# EAGLE design audio_capelet (EAGLE 6.5.0)
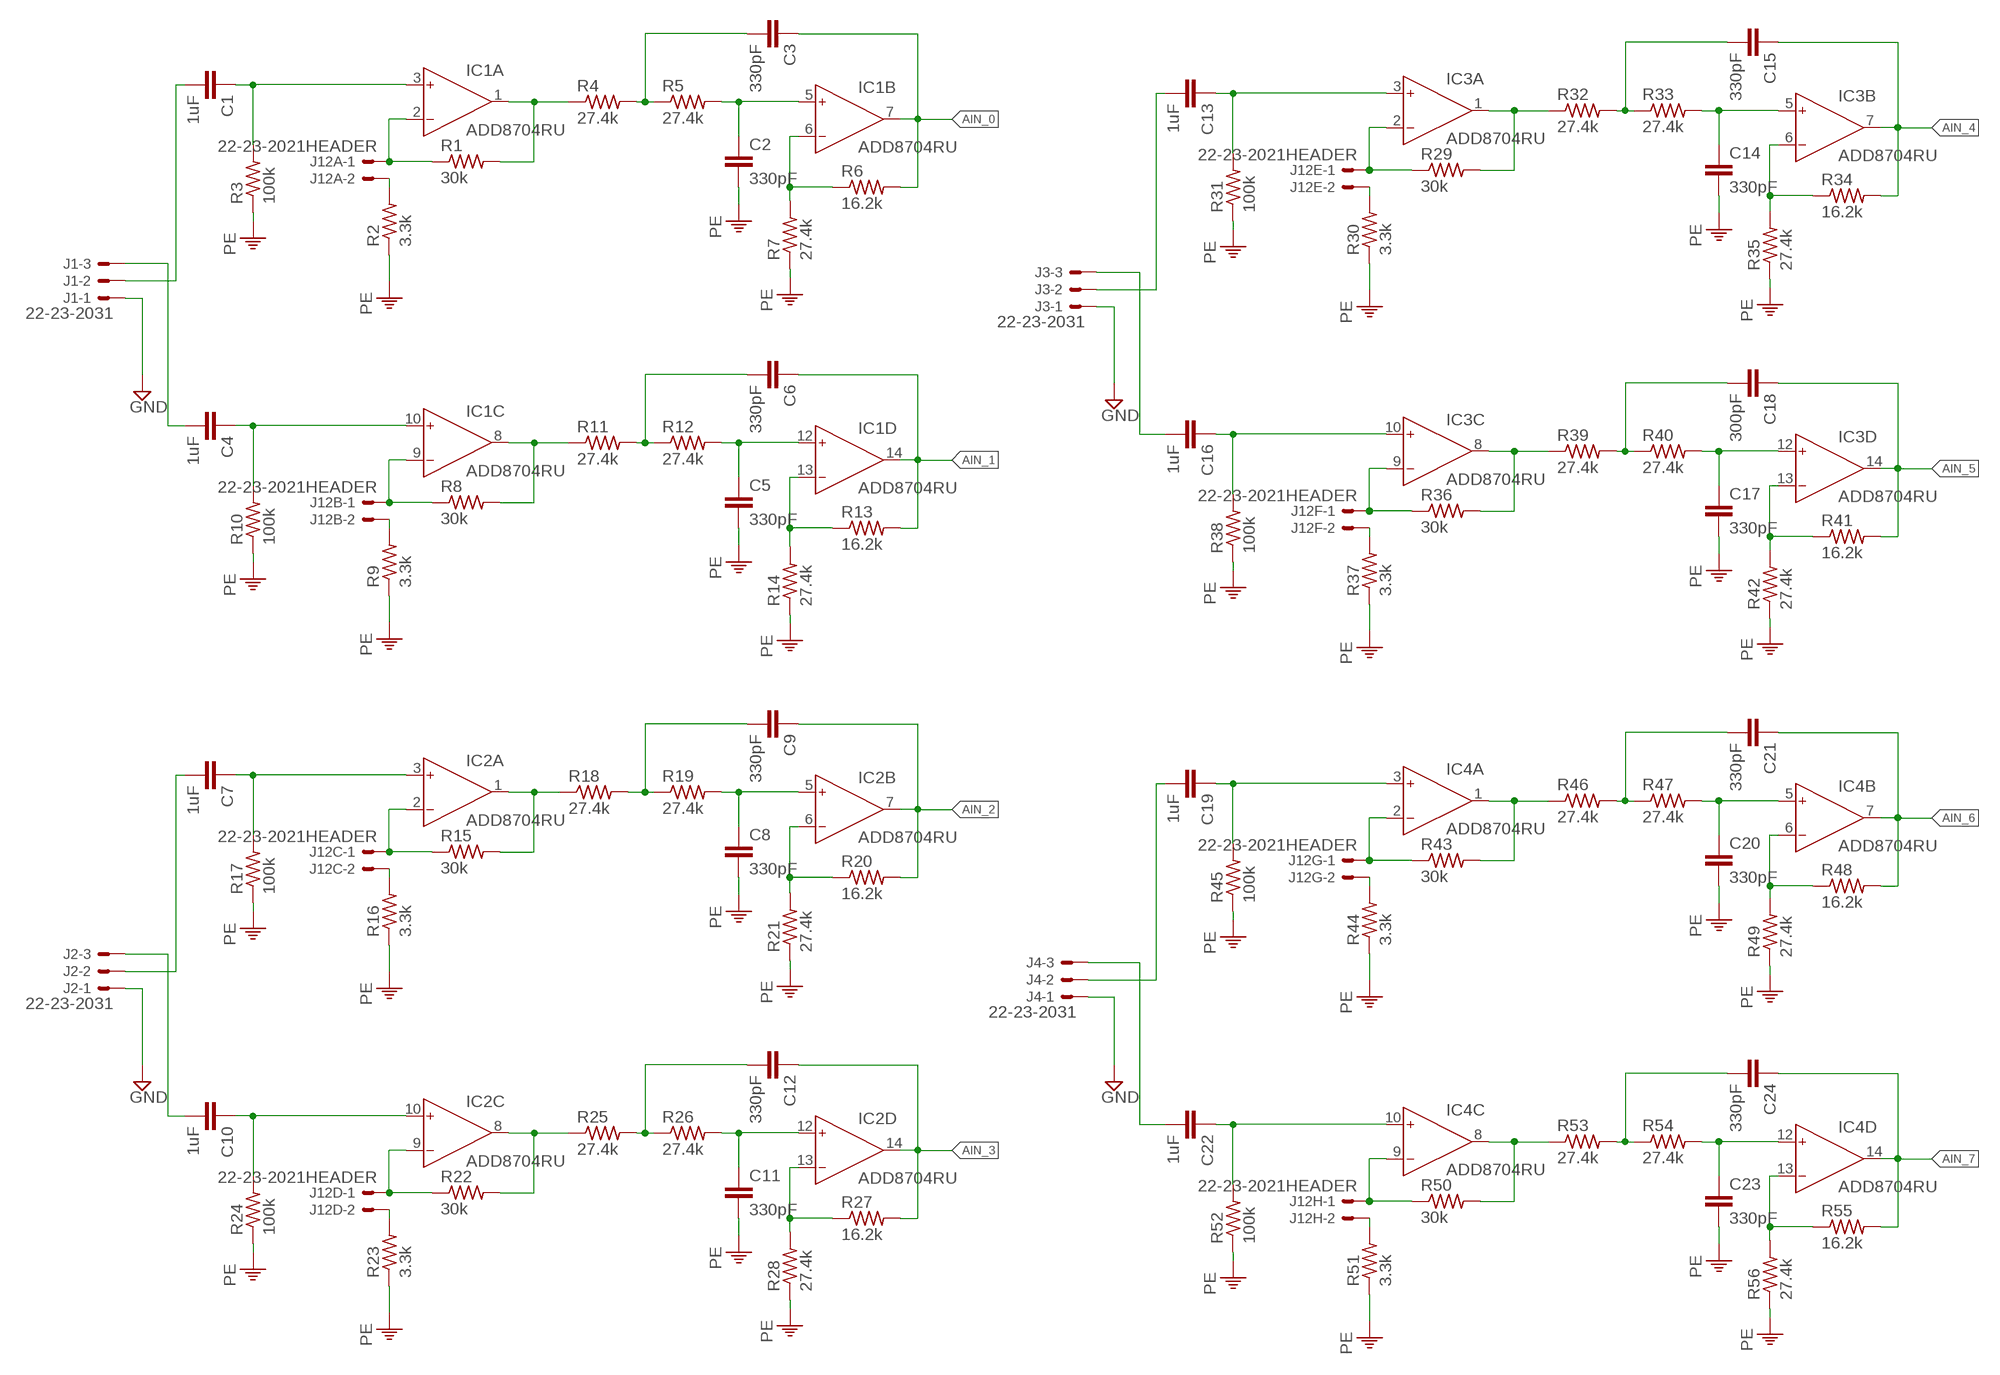
[diagram p0: schematic, sheet 1, part 1 of 2]
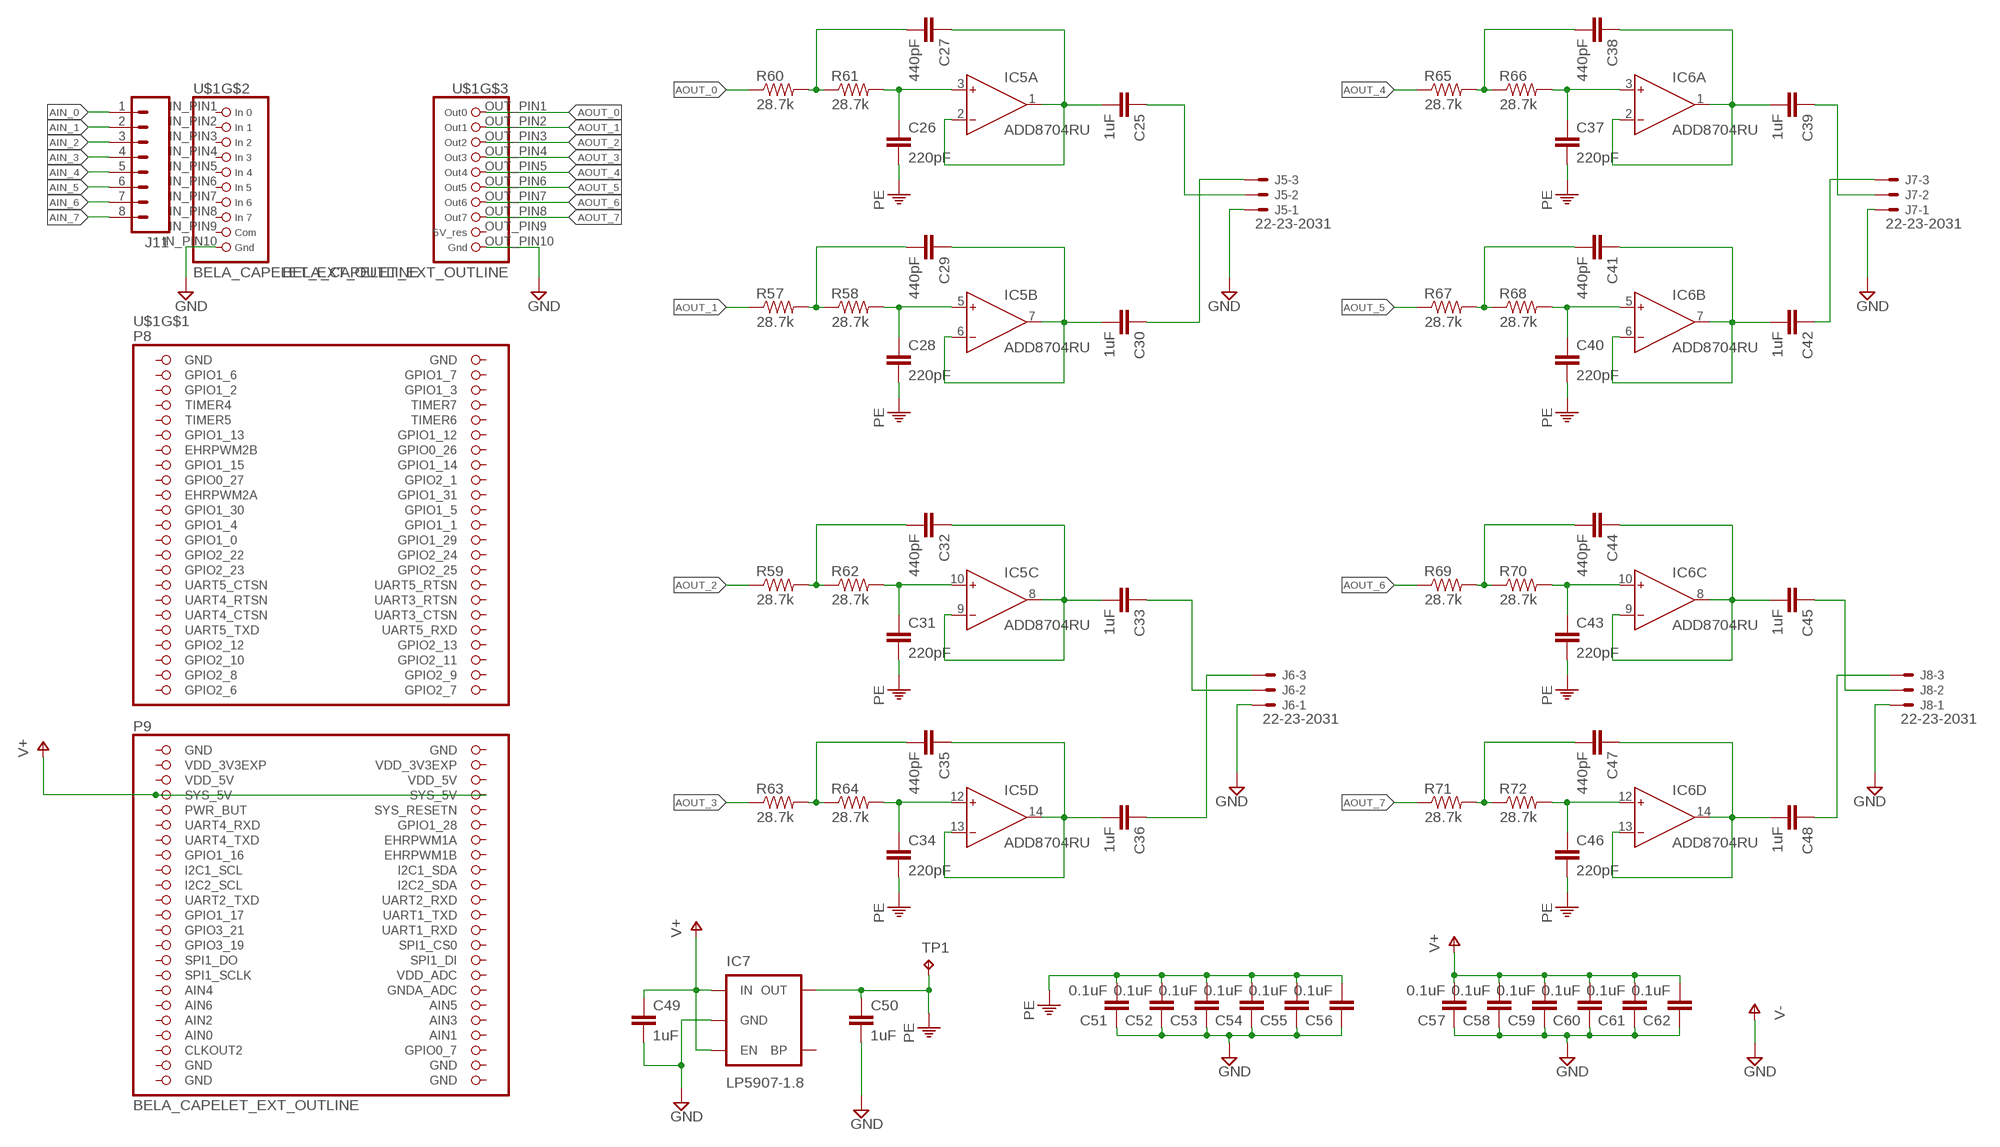
[diagram p1: schematic, sheet 1, part 2 of 2]

## Parts
C1  1uF  C-EUC0603  [C0603]
C2  330pF  C-EUC0603  [C0603]
C3  330pF  C-EUC0603  [C0603]
C4  1uF  C-EUC0603  [C0603]
C5  330pF  C-EUC0603  [C0603]
C6  330pF  C-EUC0603  [C0603]
C7  1uF  C-EUC0603  [C0603]
C8  330pF  C-EUC0603  [C0603]
C9  330pF  C-EUC0603  [C0603]
C10  1uF  C-EUC0603  [C0603]
C11  330pF  C-EUC0603  [C0603]
C12  330pF  C-EUC0603  [C0603]
C13  1uF  C-EUC0603  [C0603]
C14  330pF  C-EUC0603  [C0603]
C15  330pF  C-EUC0603  [C0603]
C16  1uF  C-EUC0603  [C0603]
C17  330pF  C-EUC0603  [C0603]
C18  300pF  C-EUC0603  [C0603]
C19  1uF  C-EUC0603  [C0603]
C20  330pF  C-EUC0603  [C0603]
C21  330pF  C-EUC0603  [C0603]
C22  1uF  C-EUC0603  [C0603]
C23  330pF  C-EUC0603  [C0603]
C24  330pF  C-EUC0603  [C0603]
C25  1uF  C-EUC0603  [C0603]
C26  220pF  C-EUC0603  [C0603]
C27  440pF  C-EUC0603  [C0603]
C28  220pF  C-EUC0603  [C0603]
C29  440pF  C-EUC0603  [C0603]
C30  1uF  C-EUC0603  [C0603]
C31  220pF  C-EUC0603  [C0603]
C32  440pF  C-EUC0603  [C0603]
C33  1uF  C-EUC0603  [C0603]
C34  220pF  C-EUC0603  [C0603]
C35  440pF  C-EUC0603  [C0603]
C36  1uF  C-EUC0603  [C0603]
C37  220pF  C-EUC0603  [C0603]
C38  440pF  C-EUC0603  [C0603]
C39  1uF  C-EUC0603  [C0603]
C40  220pF  C-EUC0603  [C0603]
C41  440pF  C-EUC0603  [C0603]
C42  1uF  C-EUC0603  [C0603]
C43  220pF  C-EUC0603  [C0603]
C44  440pF  C-EUC0603  [C0603]
C45  1uF  C-EUC0603  [C0603]
C46  220pF  C-EUC0603  [C0603]
C47  440pF  C-EUC0603  [C0603]
C48  1uF  C-EUC0603  [C0603]
C49  1uF  C-EUC0603  [C0603]
C50  1uF  C-EUC0603  [C0603]
C51  0.1uF  C-EUC0603  [C0603]
C52  0.1uF  C-EUC0603  [C0603]
C53  0.1uF  C-EUC0603  [C0603]
C54  0.1uF  C-EUC0603  [C0603]
C55  0.1uF  C-EUC0603  [C0603]
C56  0.1uF  C-EUC0603  [C0603]
C57  0.1uF  C-EUC0603  [C0603]
C58  0.1uF  C-EUC0603  [C0603]
C59  0.1uF  C-EUC0603  [C0603]
C60  0.1uF  C-EUC0603  [C0603]
C61  0.1uF  C-EUC0603  [C0603]
C62  0.1uF  C-EUC0603  [C0603]
IC1  ADD8704RU  [TSSOP14]
IC2  ADD8704RU  [TSSOP14]
IC3  ADD8704RU  [TSSOP14]
IC4  ADD8704RU  [TSSOP14]
IC5  ADD8704RU  [TSSOP14]
IC6  ADD8704RU  [TSSOP14]
IC7  LP5907-1.8  V_REG_LDOSMD  [SOT23-5]
J1  22-23-2031  [22-23-2031]
J2  22-23-2031  [22-23-2031]
J3  22-23-2031  [22-23-2031]
J4  22-23-2031  [22-23-2031]
J5  22-23-2031  [22-23-2031]
J6  22-23-2031  [22-23-2031]
J7  22-23-2031  [22-23-2031]
J8  22-23-2031  [22-23-2031]
J11  M08SMALL_DIAMETER  [1X08_SMALL_DIAMETER]
J12A  22-23-2021HEADER  [1X02]
J12B  22-23-2021HEADER  [1X02]
J12C  22-23-2021HEADER  [1X02]
J12D  22-23-2021HEADER  [1X02]
J12E  22-23-2021HEADER  [1X02]
J12F  22-23-2021HEADER  [1X02]
J12G  22-23-2021HEADER  [1X02]
J12H  22-23-2021HEADER  [1X02]
R1  30k  R-US_R0603  [R0603]
R2  3.3k  R-US_R0603  [R0603]
R3  100k  R-US_R0603  [R0603]
R4  27.4k  R-US_R0603  [R0603]
R5  27.4k  R-US_R0603  [R0603]
R6  16.2k  R-US_R0603  [R0603]
R7  27.4k  R-US_R0603  [R0603]
R8  30k  R-US_R0603  [R0603]
R9  3.3k  R-US_R0603  [R0603]
R10  100k  R-US_R0603  [R0603]
R11  27.4k  R-US_R0603  [R0603]
R12  27.4k  R-US_R0603  [R0603]
R13  16.2k  R-US_R0603  [R0603]
R14  27.4k  R-US_R0603  [R0603]
R15  30k  R-US_R0603  [R0603]
R16  3.3k  R-US_R0603  [R0603]
R17  100k  R-US_R0603  [R0603]
R18  27.4k  R-US_R0603  [R0603]
R19  27.4k  R-US_R0603  [R0603]
R20  16.2k  R-US_R0603  [R0603]
R21  27.4k  R-US_R0603  [R0603]
R22  30k  R-US_R0603  [R0603]
R23  3.3k  R-US_R0603  [R0603]
R24  100k  R-US_R0603  [R0603]
R25  27.4k  R-US_R0603  [R0603]
R26  27.4k  R-US_R0603  [R0603]
R27  16.2k  R-US_R0603  [R0603]
R28  27.4k  R-US_R0603  [R0603]
R29  30k  R-US_R0603  [R0603]
R30  3.3k  R-US_R0603  [R0603]
R31  100k  R-US_R0603  [R0603]
R32  27.4k  R-US_R0603  [R0603]
R33  27.4k  R-US_R0603  [R0603]
R34  16.2k  R-US_R0603  [R0603]
R35  27.4k  R-US_R0603  [R0603]
R36  30k  R-US_R0603  [R0603]
R37  3.3k  R-US_R0603  [R0603]
R38  100k  R-US_R0603  [R0603]
R39  27.4k  R-US_R0603  [R0603]
R40  27.4k  R-US_R0603  [R0603]
R41  16.2k  R-US_R0603  [R0603]
R42  27.4k  R-US_R0603  [R0603]
R43  30k  R-US_R0603  [R0603]
R44  3.3k  R-US_R0603  [R0603]
R45  100k  R-US_R0603  [R0603]
R46  27.4k  R-US_R0603  [R0603]
R47  27.4k  R-US_R0603  [R0603]
R48  16.2k  R-US_R0603  [R0603]
R49  27.4k  R-US_R0603  [R0603]
R50  30k  R-US_R0603  [R0603]
R51  3.3k  R-US_R0603  [R0603]
R52  100k  R-US_R0603  [R0603]
R53  27.4k  R-US_R0603  [R0603]
R54  27.4k  R-US_R0603  [R0603]
R55  16.2k  R-US_R0603  [R0603]
R56  27.4k  R-US_R0603  [R0603]
R57  28.7k  R-US_R0603  [R0603]
R58  28.7k  R-US_R0603  [R0603]
R59  28.7k  R-US_R0603  [R0603]
R60  28.7k  R-US_R0603  [R0603]
R61  28.7k  R-US_R0603  [R0603]
R62  28.7k  R-US_R0603  [R0603]
R63  28.7k  R-US_R0603  [R0603]
R64  28.7k  R-US_R0603  [R0603]
R65  28.7k  R-US_R0603  [R0603]
R66  28.7k  R-US_R0603  [R0603]
R67  28.7k  R-US_R0603  [R0603]
R68  28.7k  R-US_R0603  [R0603]
R69  28.7k  R-US_R0603  [R0603]
R70  28.7k  R-US_R0603  [R0603]
R71  28.7k  R-US_R0603  [R0603]
R72  28.7k  R-US_R0603  [R0603]
TP1  TPPAD1-17Y  [P1-17Y]
U$1  BELA_CAPELET_EXT_OUTLINE  [BELA_CAPELET_EXTENDED_OUTLINE]

## Nets
01: C30.1 J5.3
AIN_0: C3.1 IC1.7(B:OUT) J11.1 R6.2
AIN_1: C6.1 IC1.14(D:OUT) J11.2 R13.2
AIN_2: C9.1 IC2.7(B:OUT) J11.3 R20.2
AIN_3: C12.1 IC2.14(D:OUT) J11.4 R27.2
AIN_4: C15.1 IC3.7(B:OUT) J11.5 R34.2
AIN_5: C18.1 IC3.14(D:OUT) J11.6 R41.2
AIN_6: C21.1 IC4.7(B:OUT) J11.7 R48.2
AIN_7: C24.1 IC4.14(D:OUT) J11.8 R55.2
AOUT_0: R60.1 U$1.OUT_PIN1
AOUT_1: R57.1 U$1.OUT_PIN2
AOUT_2: R59.1 U$1.OUT_PIN3
AOUT_3: R63.1 U$1.OUT_PIN4
AOUT_4: R65.1 U$1.OUT_PIN5
AOUT_5: R67.1 U$1.OUT_PIN6
AOUT_6: R69.1 U$1.OUT_PIN7
AOUT_7: R71.1 U$1.OUT_PIN8
N$1: C2.1 IC1.5(B:IN+) R5.2
N$2: IC1.2(A:IN-) J12A.1 R1.1
N$3: IC1.1(A:OUT) R1.2 R4.1
N$4: C3.2 R4.2 R5.1
N$5: C25.2 C27.1 IC5.1(A:OUT) IC5.2(A:IN-)
N$6: IC1.6(B:IN-) R6.1 R7.2
N$7: C1.1 IC1.3(A:IN+) R3.2
N$8: J12A.2 R2.2
N$9: IC1.8(C:OUT) R8.2 R11.1
N$10: C6.2 R11.2 R12.1
N$11: C5.1 IC1.12(D:IN+) R12.2
N$12: C27.2 R60.2 R61.1
N$13: IC1.13(D:IN-) R13.1 R14.2
N$14: IC2.1(A:OUT) R15.2 R18.1
N$15: C4.1 IC1.10(C:IN+) R10.2
N$16: IC1.9(C:IN-) J12B.1 R8.1
N$17: C1.2 J1.2
N$18: C4.2 J1.3
N$19: IC2.2(A:IN-) J12C.1 R15.1
N$20: C9.2 R18.2 R19.1
N$21: C8.1 IC2.5(B:IN+) R19.2
N$22: C26.1 IC5.3(A:IN+) R61.2
N$23: IC2.6(B:IN-) R20.1 R21.2
N$24: J12C.2 R16.2
N$25: C7.1 IC2.3(A:IN+) R17.2
N$26: IC2.8(C:OUT) R22.2 R25.1
N$28: C12.2 R25.2 R26.1
N$29: C11.1 IC2.12(D:IN+) R26.2
N$30: C29.2 R57.2 R58.1
N$31: IC2.13(D:IN-) R27.1 R28.2
N$32: IC2.9(C:IN-) J12D.1 R22.1
N$33: J12D.2 R23.2
N$34: C10.1 IC2.10(C:IN+) R24.2
N$35: C7.2 J2.2
N$36: C10.2 J2.3
N$37: IC3.1(A:OUT) R29.2 R32.1
N$38: C15.2 R32.2 R33.1
N$39: C14.1 IC3.5(B:IN+) R33.2
N$40: C28.1 IC5.5(B:IN+) R58.2
N$41: IC3.6(B:IN-) R34.1 R35.2
N$42: C13.1 IC3.3(A:IN+) R31.2
N$43: IC3.2(A:IN-) J12E.1 R29.1
N$44: J12E.2 R30.2
N$45: IC3.8(C:OUT) R36.2 R39.1
N$46: C18.2 R39.2 R40.1
N$47: C17.1 IC3.12(D:IN+) R40.2
N$48: C29.1 C30.2 IC5.6(B:IN-) IC5.7(B:OUT)
N$49: IC3.13(D:IN-) R41.1 R42.2
N$50: C16.1 IC3.10(C:IN+) R38.2
N$51: IC3.9(C:IN-) J12F.1 R36.1
N$52: J12F.2 R37.2
N$53: C13.2 J3.2
N$54: C16.2 J3.3
N$55: IC4.1(A:OUT) R43.2 R46.1
N$56: C21.2 R46.2 R47.1
N$57: C20.1 IC4.5(B:IN+) R47.2
N$58: C32.2 R59.2 R62.1
N$59: IC4.6(B:IN-) R48.1 R49.2
N$60: C19.1 IC4.3(A:IN+) R45.2
N$61: IC4.2(A:IN-) J12G.1 R43.1
N$62: J12G.2 R44.2
N$63: IC4.8(C:OUT) R50.2 R53.1
N$64: C24.2 R53.2 R54.1
N$65: C23.1 IC4.12(D:IN+) R54.2
N$66: C31.1 IC5.10(C:IN+) R62.2
N$67: IC4.13(D:IN-) R55.1 R56.2
N$68: C22.1 IC4.10(C:IN+) R52.2
N$69: IC4.9(C:IN-) J12H.1 R50.1
N$70: J12H.2 R51.2
N$71: C19.2 J4.2
N$72: C22.2 J4.3
N$73: C32.1 C33.2 IC5.8(C:OUT) IC5.9(C:IN-)
N$74: C35.2 R63.2 R64.1
N$75: C34.1 IC5.12(D:IN+) R64.2
N$76: C35.1 C36.2 IC5.13(D:IN-) IC5.14(D:OUT)
N$77: C38.2 R65.2 R66.1
N$78: C37.1 IC6.3(A:IN+) R66.2
N$79: J12B.2 R9.2
N$80: C38.1 C39.2 IC6.1(A:OUT) IC6.2(A:IN-)
N$81: C41.2 R67.2 R68.1
N$82: C40.1 IC6.5(B:IN+) R68.2
N$83: C41.1 C42.2 IC6.6(B:IN-) IC6.7(B:OUT)
N$84: C44.2 R69.2 R70.1
N$85: C43.1 IC6.10(C:IN+) R70.2
N$86: C44.1 C45.2 IC6.8(C:OUT) IC6.9(C:IN-)
N$87: C47.2 R71.2 R72.1
N$88: C46.1 IC6.12(D:IN+) R72.2
N$89: C47.1 C48.2 IC6.13(D:IN-) IC6.14(D:OUT)
N$90: C45.1 J8.2
N$91: C39.1 J7.2
O0: C25.1 J5.2
O2: C33.1 J6.2
O3: C36.1 J6.3
O5: C42.1 J7.3
O7: C48.1 J8.3
PE: C2.2 C5.2 C8.2 C11.2 C14.2 C17.2 C20.2 C23.2 C26.2 C28.2 C31.2 C34.2 C37.2 C40.2 C43.2 C46.2 C50.1 C51.2 C52.2 C53.2 C54.2 C55.2 C56.2 IC7.5(OUT) R2.1 R3.1 R7.1 R9.1 R10.1 R14.1 R16.1 R17.1 R21.1 R23.1 R24.1 R28.1 R30.1 R31.1 R35.1 R37.1 R38.1 R42.1 R44.1 R45.1 R49.1 R51.1 R52.1 R56.1 TP1.TP
V+: C49.1 C57.2 C58.2 C59.2 C60.2 C61.2 C62.2 IC7.1(IN) IC7.3(EN) U$1.53(SYS_5V) U$1.54(SYS_5V)
V-: C49.2 C50.2 C51.1 C52.1 C53.1 C54.1 C55.1 C56.1 C57.1 C58.1 C59.1 C60.1 C61.1 C62.1 IC7.2(GND) J1.1 J2.1 J3.1 J4.1 J5.1 J6.1 J7.1 J8.1 U$1.IN_PIN10 U$1.OUT_PIN10 ; supply symbol labelled GND
Unconnected: IC7.4(BP) U$1.3(GPIO1_6) U$1.4(GPIO1_7) U$1.5(GPIO1_2) U$1.6(GPIO1_3) U$1.7(TIMER4) U$1.8(TIMER7) U$1.9(TIMER5) U$1.10(TIMER6) U$1.11(GPIO1_13) U$1.12(GPIO1_12) U$1.13(EHRPWM2B) U$1.14(GPIO0_26) U$1.15(GPIO1_15) U$1.16(GPIO1_14) U$1.17(GPIO0_27) U$1.18(GPIO2_1) U$1.19(EHRPWM2A) U$1.20(GPIO1_31) U$1.21(GPIO1_30) U$1.22(GPIO1_5) U$1.23(GPIO1_4) U$1.24(GPIO1_1) U$1.25(GPIO1_0) U$1.26(GPIO1_29) U$1.27(GPIO2_22) U$1.28(GPIO2_24) U$1.29(GPIO2_23) U$1.30(GPIO2_25) U$1.31(UART5_CTSN) U$1.32(UART5_RTSN) U$1.33(UART4_RTSN) U$1.34(UART3_RTSN) U$1.35(UART4_CTSN) U$1.36(UART3_CTSN) U$1.37(UART5_TXD) U$1.38(UART5_RXD) U$1.39(GPIO2_12) U$1.40(GPIO2_13) U$1.41(GPIO2_10) U$1.42(GPIO2_11) U$1.43(GPIO2_8) U$1.44(GPIO2_9) U$1.45(GPIO2_6) U$1.46(GPIO2_7) U$1.55(PWR_BUT) U$1.56(SYS_RESETN) U$1.57(UART4_RXD) U$1.58(GPIO1_28) U$1.59(UART4_TXD) U$1.60(EHRPWM1A) U$1.61(GPIO1_16) U$1.62(EHRPWM1B) U$1.63(I2C1_SCL) U$1.64(I2C1_SDA) U$1.65(I2C2_SCL) U$1.66(I2C2_SDA) U$1.67(UART2_TXD) U$1.68(UART2_RXD) U$1.69(GPIO1_17) U$1.70(UART1_TXD) U$1.71(GPIO3_21) U$1.72(UART1_RXD) U$1.73(GPIO3_19) U$1.74(SPI1_CS0) U$1.75(SPI1_DO) U$1.76(SPI1_DI) U$1.77(SPI1_SCLK) U$1.78(VDD_ADC) U$1.79(AIN4) U$1.80(GNDA_ADC) U$1.81(AIN6) U$1.82(AIN5) U$1.83(AIN2) U$1.84(AIN3) U$1.86(AIN1) U$1.87(CLKOUT2) U$1.88(GPIO0_7) U$1.IN_PIN1 U$1.IN_PIN2 U$1.IN_PIN3 U$1.IN_PIN4 U$1.IN_PIN5 U$1.IN_PIN6 U$1.IN_PIN7 U$1.IN_PIN8 U$1.IN_PIN9 U$1.OUT_PIN9

## Power pins joined to a net without a drawn wire
AIN0: U$1.85(AIN0)
V+: IC1.4(P:V+) IC2.4(P:V+) IC3.4(P:V+) IC4.4(P:V+) IC5.4(P:V+) IC6.4(P:V+)
V-: IC1.11(P:V-) IC2.11(P:V-) IC3.11(P:V-) IC4.11(P:V-) IC5.11(P:V-) IC6.11(P:V-) U$1.1(GND) U$1.2(GND) U$1.47(GND) U$1.48(GND) U$1.89(GND) U$1.90(GND) U$1.91(GND) U$1.92(GND)
VDD_3V3EXP: U$1.49(VDD_3V3EXP) U$1.50(VDD_3V3EXP)
VDD_5V: U$1.51(VDD_5V) U$1.52(VDD_5V)

## Library data of the parts
C1-C62 = resistor:C-EU: CAPACITOR, European symbol
IC1-IC6 = analog-devices:ADD8704: 16 V Quad Operational Amplifier Source: Ananlog Devices .. 780914713ADD8704_0.pdf; MF: ALTERA CORPORATION; MPN: ADD8704ARUZ-REEL; OC_FARNELL: unknown; OC_NEWARK: 59K0964
IC7 = PDue:V_REG_LDO: Voltage Regulator LDO Standard 150mA LDO voltage regulator in SOT-23 layout. Micrel part MIC5205. BP (by-pass) pin is used to lower output noise with 470pF cap.
J1-J8 = con-molex:22-23-2031: .100" (2.54mm) Center Header - 3 Pin; MF: MOLEX; MPN: 22-23-2031; OC_FARNELL: 1462950; OC_NEWARK: 30C0862
J11 = bela_capelet:M08: Header 8 Standard 8-pin 0.1" header. Use with straight break away headers (SKU : PRT-00116), right angle break away headers (PRT-00553), swiss pins (PRT-00743), machine pins (PRT-00117), and female headers (PRT-00115).
J12A J12B J12C J12D J12E J12F J12G J12H = PDue:22-23-2021: .100" (2.54mm) Center Header - 2 Pin
R1-R72 = resistor:R-US_: RESISTOR, American symbol
TP1 = testpad:TP: Test pad
U$1 = bela_capelet:BELA_CAPELET: Should match A3 pinout - but not completely tested

## Board
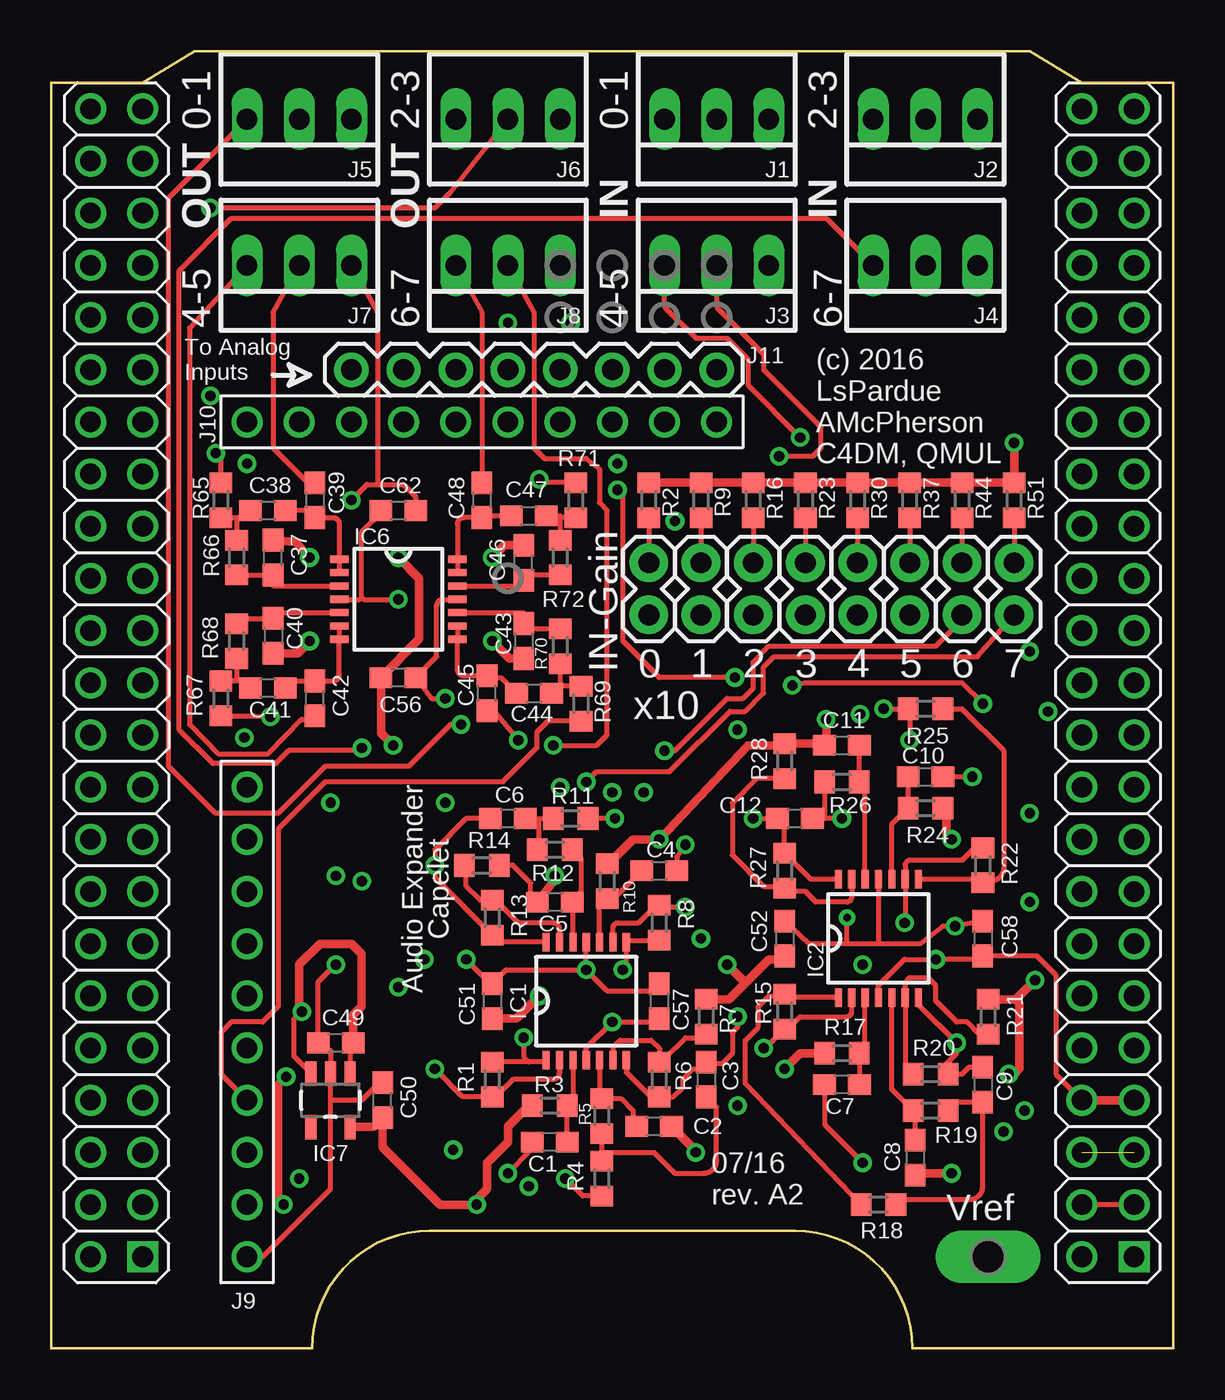
[diagram p2: board, top side]
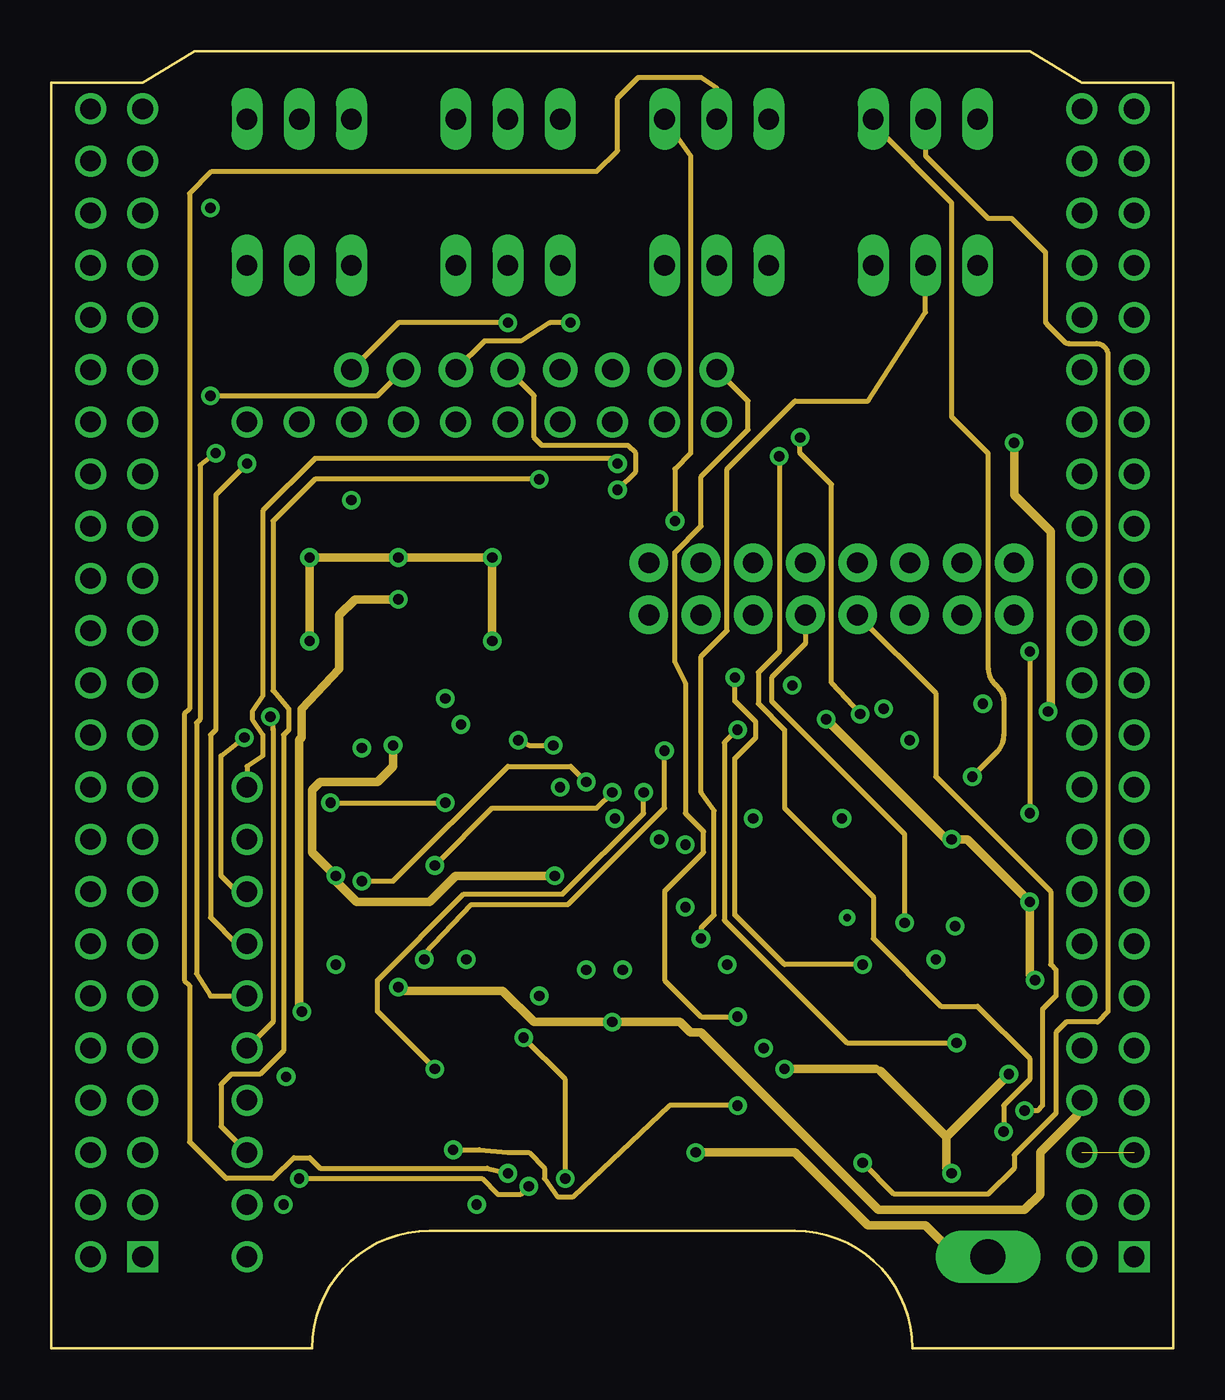
[diagram p3: board, inner layer Route2]
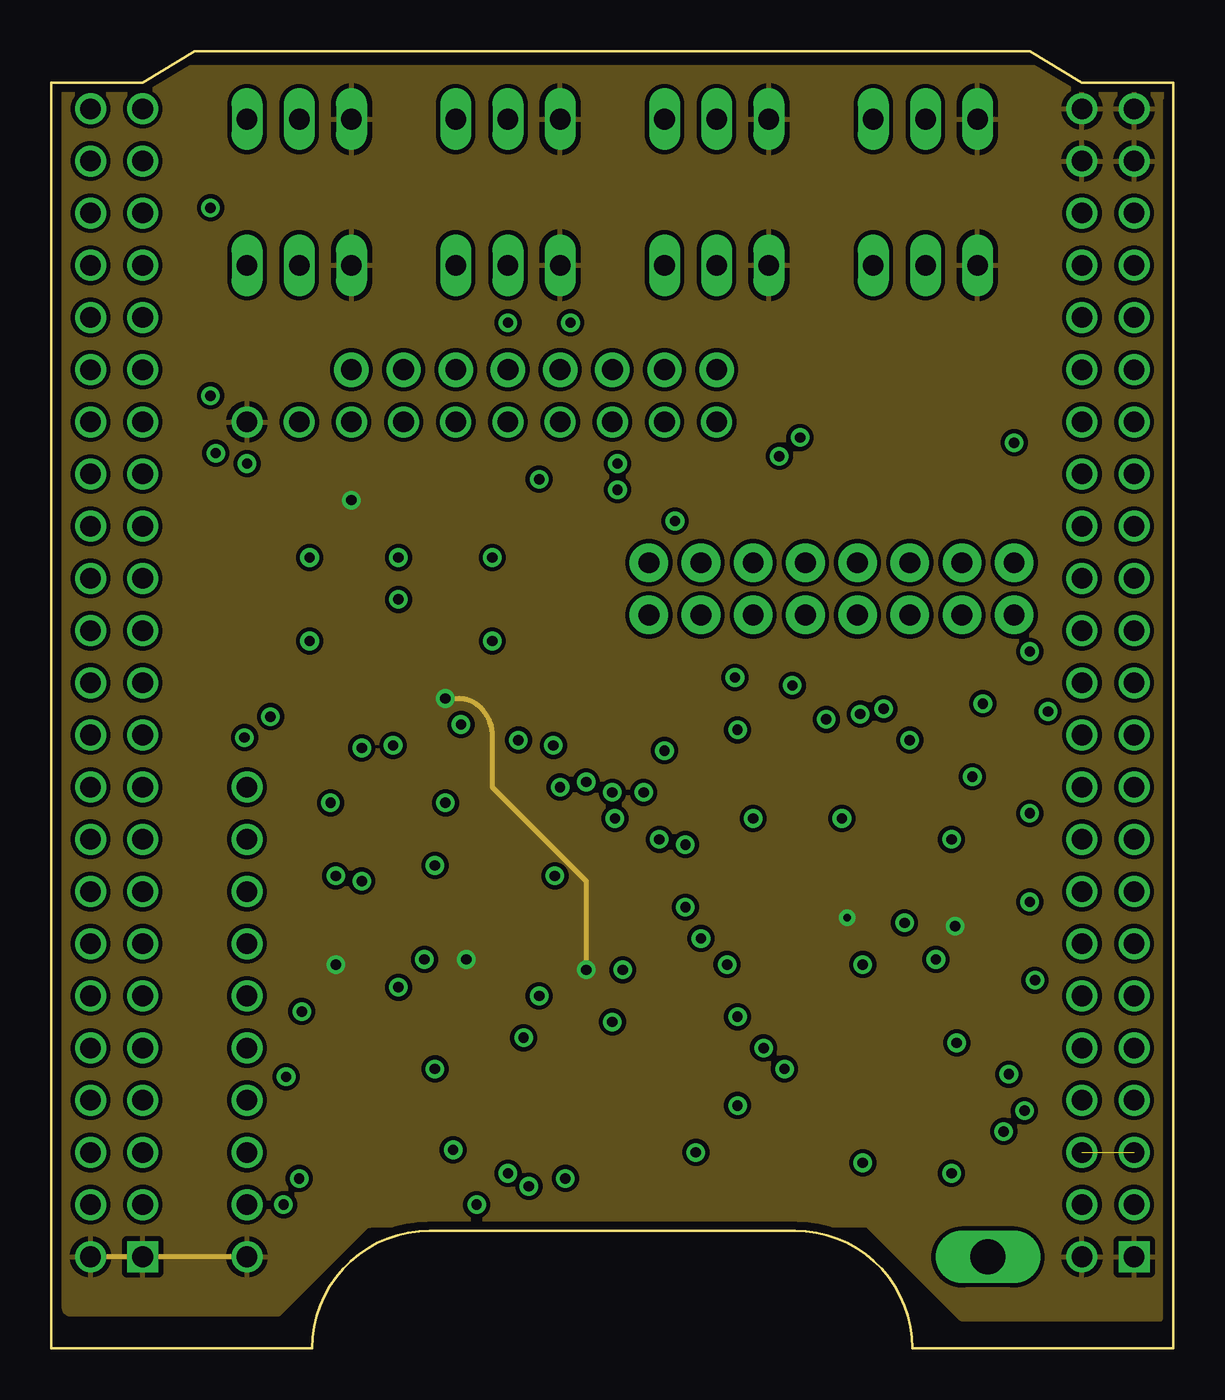
[diagram p4: board, inner layer Route15]
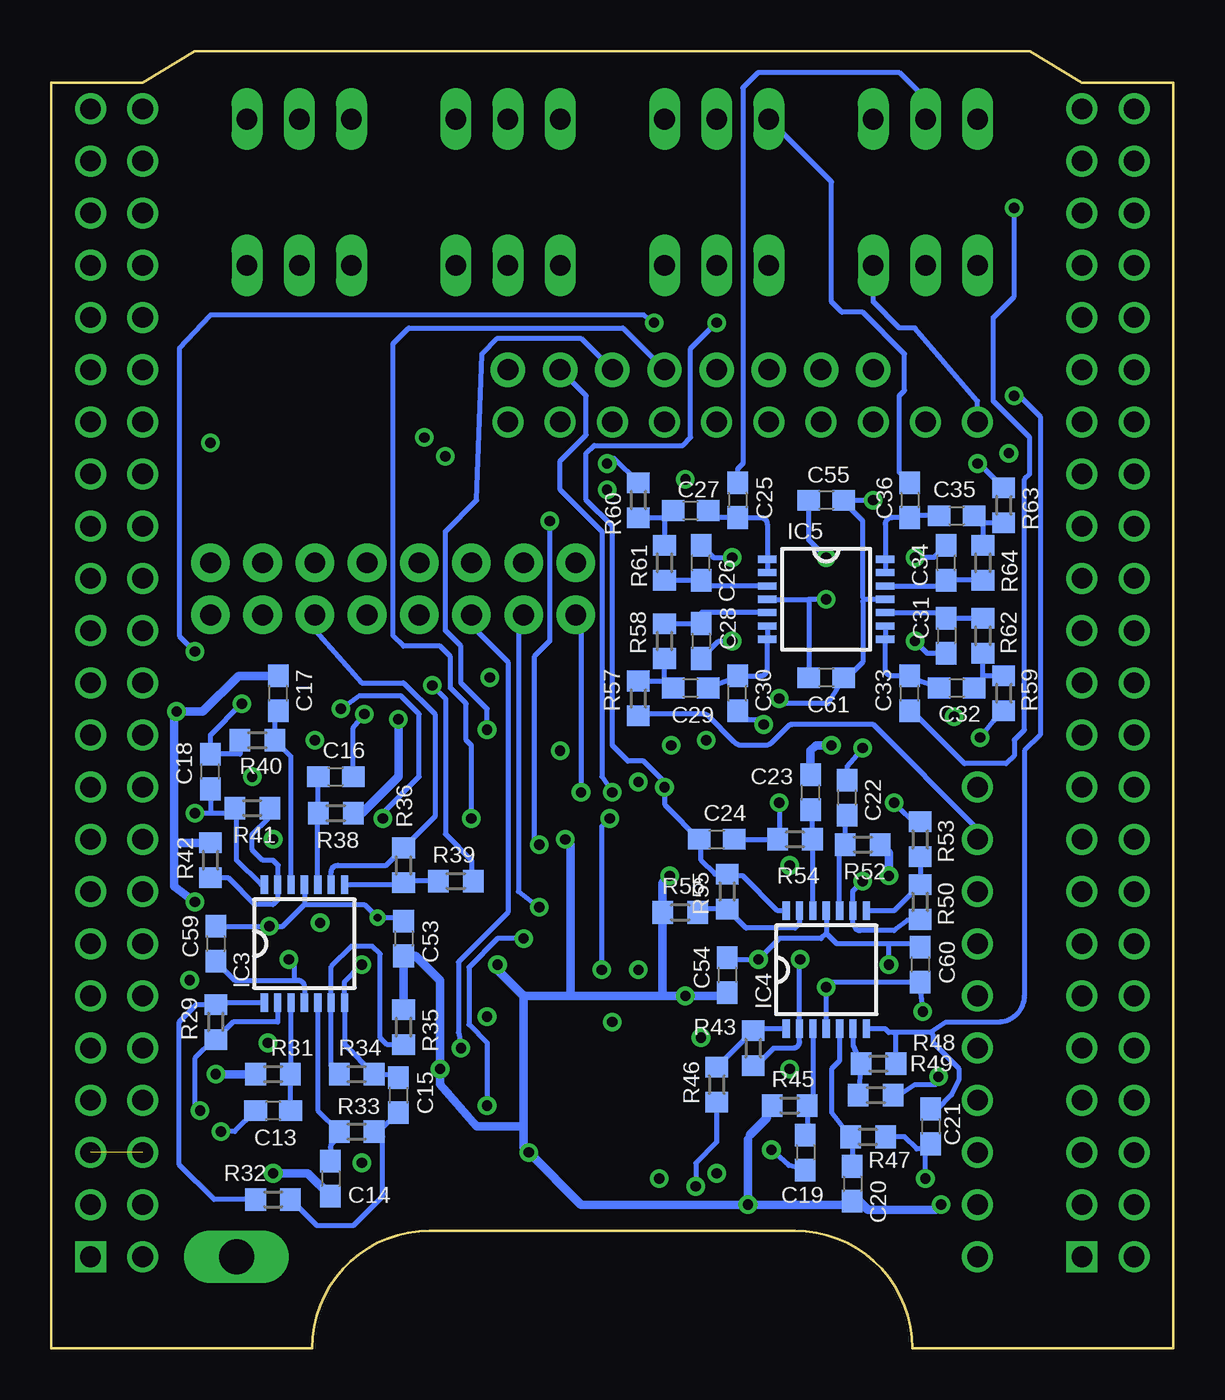
[diagram p5: board, bottom side, seen from below]

Size 54.61 x 63.12 mm. Coordinates in mm from the lower left corner, seen from the top.
Copper layers (1*2*15*16): Top 0.035mm / dielectric 1.5mm / Route2 0.035mm / dielectric 0.15mm / Route15 0.035mm / dielectric 0.2mm / Bottom 0.035mm
Design rules "default *": minimum track width 8mil, minimum drill 15mil, track to track 8mil, track to pad 8mil, pad to pad 8mil, via to via 8mil, smd to smd 0mil, copper to edge 15mil, drill to drill 8mil, minimum pad ring 10mil, minimum via ring 8mil, stop-mask expansion 8mil, vias tented up to drill 20mil, thermal gap 10mil

### Footprints (pad centres in the part's own frame; a part is rotated, then mirrored left to right if it is on the bottom)
C0603 = smd 1.1 x 1: 1 -0.85,0; 2 0.85,0
TSSOP14 = smd 0.9 x 0.35: 1 -2.875,1.95; 2 -2.875,1.3; 3 -2.875,0.65; 4 -2.875,0; 5 -2.875,-0.65; 6 -2.875,-1.3; 7 -2.875,-1.95; 8 2.875,-1.95; 9 2.875,-1.3; 10 2.875,-0.65; 11 2.875,0; 12 2.875,0.65; 13 2.875,1.3; 14 2.875,1.95
SOT23-5 = smd 0.55 x 1.2: 1 -0.95,-1.3; 2 0,-1.3; 3 0.95,-1.3; 4 0.95,1.3; 5 -0.95,1.3
22-23-2031 = drill 1 long: 1 -2.54,0; 2 0,0; 3 2.54,0
1X08_SMALL_DIAMETER = drill 1.016 pad 1.676: 1 0,0; 2 2.54,0; 3 5.08,0; 4 7.62,0; 5 10.16,0; 6 12.7,0; 7 15.24,0; 8 17.78,0
1X02 = drill 1.016 pad 1.88: 1 0,0; 2 2.54,0
R0603 = smd 1 x 1.1: 1 -0.85,0; 2 0.85,0
P1-17Y = drill 1.702 pad 2.121 long: TP 0,0
BELA_CAPELET_EXTENDED_OUTLINE = drill 1 square: 1 2.54,16.51; 47 50.8,16.51 | drill 1: 2 0,16.51; 3 2.54,19.05; 4 0,19.05; 5 2.54,21.59; 6 0,21.59; 7 2.54,24.13; 8 0,24.13; 9 2.54,26.67; 10 0,26.67; 11 2.54,29.21; 12 0,29.21; 13 2.54,31.75; 14 0,31.75; 15 2.54,34.29; 16 0,34.29; 17 2.54,36.83; 18 0,36.83; 19 2.54,39.37; 20 0,39.37; 21 2.54,41.91; 22 0,41.91; 23 2.54,44.45; 24 0,44.45; 25 2.54,46.99; 26 0,46.99; 27 2.54,49.53; 28 0,49.53; 29 2.54,52.07; 30 0,52.07; 31 2.54,54.61; 32 0,54.61; 33 2.54,57.15; 34 0,57.15; 35 2.54,59.69; 36 0,59.69; 37 2.54,62.23; 38 0,62.23; 39 2.54,64.77; 40 0,64.77; 41 2.54,67.31; 42 0,67.31; 43 2.54,69.85; 44 0,69.85; 45 2.54,72.39; 46 0,72.39; 48 48.26,16.51; 49 50.8,19.05; 50 48.26,19.05; 51 50.8,21.59; 52 48.26,21.59; 53 50.8,24.13; 54 48.26,24.13; 55 50.8,26.67; 56 48.26,26.67; 57 50.8,29.21; 58 48.26,29.21; 59 50.8,31.75; 60 48.26,31.75; 61 50.8,34.29; 62 48.26,34.29; 63 50.8,36.83; 64 48.26,36.83; 65 50.8,39.37; 66 48.26,39.37; 67 50.8,41.91; 68 48.26,41.91; 69 50.8,44.45; 70 48.26,44.45; 71 50.8,46.99; 72 48.26,46.99; 73 50.8,49.53; 74 48.26,49.53; 75 50.8,52.07; 76 48.26,52.07; 77 50.8,54.61; 78 48.26,54.61; 79 50.8,57.15; 80 48.26,57.15; 81 50.8,59.69; 82 48.26,59.69; 83 50.8,62.23; 84 48.26,62.23; 85 50.8,64.77; 86 48.26,64.77; 87 50.8,67.31; 88 48.26,67.31; 89 50.8,69.85; 90 48.26,69.85; 91 50.8,72.39; 92 48.26,72.39; IN_PIN1 30.48,57.15; IN_PIN2 27.94,57.15; IN_PIN3 25.4,57.15; IN_PIN4 22.86,57.15; IN_PIN5 20.32,57.15; IN_PIN6 17.78,57.15; IN_PIN7 15.24,57.15; IN_PIN8 12.7,57.15; IN_PIN9 10.16,57.15; IN_PIN10 7.62,57.15; OUT_PIN1 7.62,39.37; OUT_PIN2 7.62,36.83; OUT_PIN3 7.62,34.29; OUT_PIN4 7.62,31.75; OUT_PIN5 7.62,29.21; OUT_PIN6 7.62,26.67; OUT_PIN7 7.62,24.13; OUT_PIN8 7.62,21.59; OUT_PIN9 7.62,19.05; OUT_PIN10 7.62,16.51

### Placement (x,y rotation side)
C1  24.26,10.03 180 top
C2  29.34,10.8 0 top
C3  31.88,13.08 270 top
C4  29.59,23.24 0 top
C5  24.51,21.72 180 top
C6  22.23,25.78 0 top
C7  38.48,12.83 180 top
C8  42.04,9.27 270 top
C9  45.34,12.83 270 top
C10  42.54,27.81 0 top
C11  38.48,29.34 180 top
C12  36.2,25.78 0 top
C13  43.81,11.56 180 bottom
C14  41.02,8.26 270 bottom
C15  37.72,12.32 270 bottom
C16  40.77,27.81 0 bottom
C17  43.56,31.88 90 bottom
C18  46.86,28.07 90 bottom
C19  17.91,9.53 270 bottom
C20  15.62,8 270 bottom
C21  11.81,10.8 270 bottom
C22  15.87,26.8 90 bottom
C23  17.65,27.05 90 bottom
C24  22.23,24.77 0 bottom
C25  21.21,41.28 270 bottom
C26  22.99,38.23 90 bottom
C27  23.5,40.77 180 bottom
C28  22.99,34.42 270 bottom
C29  23.5,32.13 180 bottom
C30  21.21,31.88 90 bottom
C31  11.05,34.67 270 bottom
C32  10.54,32.13 0 bottom
C33  12.83,31.88 90 bottom
C34  11.05,38.23 90 bottom
C35  10.54,40.51 0 bottom
C36  12.83,41.28 270 bottom
C37  10.79,38.48 90 top
C38  10.54,40.77 180 top
C39  12.83,41.28 270 top
C40  10.79,34.67 270 top
C41  10.54,32.13 180 top
C42  12.83,31.62 90 top
C43  22.99,34.42 270 top
C44  23.5,31.88 0 top
C45  21.21,31.88 90 top
C46  22.99,38.23 90 top
C47  23.24,40.51 0 top
C48  20.96,41.28 270 top
C49  13.84,14.86 180 top
C50  16.13,12.07 90 top
C51  21.46,16.89 270 top
C52  35.69,19.94 270 top
C53  37.46,19.94 270 bottom
C54  21.72,18.16 270 bottom
C55  16.89,41.28 180 bottom
C56  16.89,32.64 180 top
C57  29.59,16.89 270 top
C58  45.34,19.94 270 top
C59  46.61,19.69 270 bottom
C60  12.32,18.67 270 bottom
C61  16.89,32.64 180 bottom
C62  16.89,40.77 180 top
IC1  26.04,16.89 90 top
IC2  40.26,19.94 90 top
IC3  42.29,19.69 90 bottom
IC4  16.89,18.42 90 bottom
IC5  16.89,36.45 0 bottom
IC6  16.89,36.45 0 top
IC7  13.59,12.07 180 top
J1  32.38,59.82 180 top
J2  42.54,59.82 180 top
J3  32.38,52.7 180 top
J4  42.54,52.7 180 top
J5  12.06,59.82 180 top
J6  22.23,59.82 180 top
J7  12.06,52.7 180 top
J8  22.23,52.7 180 top
J11  32.38,47.62 180 top
J12A  29.08,35.69 90 top
J12B  31.62,35.69 90 top
J12C  34.16,35.69 90 top
J12D  36.7,35.69 90 top
J12E  39.24,35.69 90 top
J12F  41.78,35.69 90 top
J12G  44.32,35.69 90 top
J12H  46.86,35.69 90 top
R1  21.46,13.08 90 top
R2  29.08,41.28 270 top
R3  24.26,11.81 0 top
R4  26.8,8.26 90 top
R5  26.8,11.3 90 top
R6  29.59,13.08 270 top
R7  31.88,16.13 270 top
R8  29.59,20.7 270 top
R9  31.62,41.28 270 top
R10  27.05,22.73 270 top
R11  25.27,25.78 180 top
R12  24.51,24.26 0 top
R13  21.46,20.96 270 top
R14  20.96,23.5 180 top
R15  35.69,16.38 90 top
R16  34.16,41.28 270 top
R17  38.48,14.35 0 top
R18  40.26,6.99 0 top
R19  42.8,11.56 180 top
R20  42.8,13.34 0 top
R21  45.59,16.13 270 top
R22  45.34,23.5 270 top
R23  36.7,41.28 270 top
R24  42.54,26.29 180 top
R25  42.54,31.12 180 top
R26  38.48,27.56 0 top
R27  35.69,23.24 90 top
R28  35.69,28.58 270 top
R29  46.61,15.88 90 bottom
R30  39.24,41.28 270 top
R31  43.81,13.34 0 bottom
R32  43.81,7.24 0 bottom
R33  39.75,10.54 180 bottom
R34  39.75,13.34 0 bottom
R35  37.46,15.62 270 bottom
R36  37.46,23.5 270 bottom
R37  41.78,41.28 270 top
R38  40.77,26.04 180 bottom
R39  34.92,22.73 0 bottom
R40  44.58,29.59 0 bottom
R41  44.83,26.29 180 bottom
R42  46.86,23.75 270 bottom
R43  20.45,14.61 90 bottom
R44  44.32,41.28 270 top
R45  18.67,11.81 0 bottom
R46  22.23,12.83 270 bottom
R47  14.86,10.29 180 bottom
R48  14.35,13.84 0 bottom
R49  14.48,12.32 180 bottom
R50  12.32,21.72 90 bottom
R51  46.86,41.28 270 top
R52  15.11,24.51 180 bottom
R53  12.32,24.77 90 bottom
R54  18.42,24.77 0 bottom
R55  21.72,22.23 90 bottom
R56  24,21.21 0 bottom
R57  26.04,31.62 90 bottom
R58  24.77,34.42 90 bottom
R59  8.25,31.88 90 bottom
R60  26.04,41.28 270 bottom
R61  24.77,38.23 270 bottom
R62  9.27,34.67 90 bottom
R63  8.25,41.02 270 bottom
R64  9.27,38.23 270 bottom
R65  8.25,41.28 270 top
R66  9.02,38.48 270 top
R67  8.25,31.62 90 top
R68  9.02,34.42 90 top
R69  25.78,31.37 90 top
R70  24.77,34.16 90 top
R71  25.53,41.28 270 top
R72  24.77,38.48 270 top
TP1  45.59,4.45 90 top
U$1  1.91,-12.06 0 top

### Tracks (layer width: path | path; a pad name or v marks a point on that pad's centre or on a via)
01  (via drill 0.5)
  Top 0.254: v19.94,30.35 19.43,30.35 17.4,28.32 13.33,28.32 11.05,26.04 8,26.04 5.71,28.32 5.71,56.01 J5.3
  Bottom 0.254: C30.1 20.7,30.61 20.19,30.61 v19.94,30.35
AIN_0  (via drill 0.5)
  Top 0.254: v33.4,16.13 33.4,15.62 33.15,15.37 33.15,14.35 32.64,13.84 31.96,13.84 C3.1 31.54,13.59 31.24,13.59 30.73,13.08 30.73,12.7 30.27,12.23 R6.2 29.5,12.32 29.08,12.32 27.98,13.42 IC1.7
  Route2 0.254: v33.4,16.13 31.62,16.13 29.85,17.91 29.85,22.23 31.75,24.13 31.75,25.15 30.86,26.04 30.86,32.39 30.35,33.4 30.35,38.73 31.62,40 31.62,42.42 33.91,44.7 33.91,46.1 J11.1
AIN_1  (via drill 0.5)
  Top 0.254: IC1.14 21.8,19.77 R13.2 18.67,22.9 v18.67,23.5 18.67,24.26 20.19,25.78 C6.1
  Route2 0.254: v18.67,23.5 21.46,26.29 26.54,26.29 v27.3,27.05
  Bottom 0.254: 27.56,27.3 v27.3,27.05 27.81,27.81 27.81,39.75 29.85,41.78 29.85,43.18 28.58,44.45 28.58,46.36 J11.2
AIN_2  (via drill 0.5)
  Top 0.254: IC2.7 42.21,16.72 v44.07,14.86 44.07,14.35 43.39,13.68 R20.2 44.32,13.34 44.66,13.68 C9.1
  Route2 0.254: v44.07,14.86 38.73,14.86 32.75,20.83 32.75,29.48 v33.4,30.1
  Bottom 0.254: v33.4,30.1 33.4,31.12 34.67,32.39 34.67,34.16 35.43,34.92 35.43,39.75 33.91,41.28 33.65,48.39 32.89,49.15 28.83,49.15 J11.3
AIN_3  (via drill 0.5)
  Top 0.254: C12.1 35.69,25.78 R27.2 36.96,22.81 IC2.14 | 35.69,25.87 C12.1 | v34.16,25.78 C12.1
  Bottom 0.254: v34.16,25.78 34.16,29.34 34.42,29.59 34.42,31.37 35.18,32.13 35.18,33.66 35.69,34.16 37.46,34.16 37.97,34.67 37.97,48.89 37.21,49.66 26.8,49.66 J11.4
AIN_4  (via drill 0.5)
  Top 0.254: v33.27,32.64 29.59,32.64 27.81,34.42 27.81,41.53 v27.56,41.78
  Route2 0.254: v39.5,18.67 35.69,18.67 33.27,21.08 33.27,28.7 34.29,29.72 34.29,30.48 33.27,31.5 v33.27,32.64 | v27.56,41.78 28.45,42.67 28.45,43.56 28.07,43.94 23.88,43.94 23.5,44.32 23.5,46.36 J11.5
  Bottom 0.254: 37.46,13.42 C15.1 37.88,13.34 R34.2 40.34,14.78 IC3.7 40.34,17.83 v39.5,18.67
AIN_5  (via drill 0.5)
  Route2 0.254: v47.62,33.91 v47.62,26.04 | v25.27,49.91 24.26,49.91 22.86,49.02 21.08,49.02 J11.6
  Bottom 0.254: C18.1 46.86,26.04 | 46.86,26.04 45.68,26.04 R41.2 45.59,26.2 45.59,23.75 44.4,22.56 IC3.14 | 46.86,26.04 v47.62,26.04 | v25.27,49.91 25.78,50.29 46.86,50.29 48.39,48.64 48.39,34.67 v47.62,33.91
AIN_6  (via drill 0.5)
  Route2 0.254: v7.75,46.36 15.87,46.36 J11.7
  Bottom 0.254: 11.81,15.37 11.05,15.88 8.53,15.88 arc-90 7.24,17.17 7.24,29.08 6.48,29.85 6.48,45.34 7.49,46.36 v7.75,46.36 | 11.81,15.37 13.59,15.37 | 13.59,15.37 13.84,15.37 14.02,15.54 IC4.7 | R48.2 13.5,15.28 13.59,15.37 | C21.1 11.47,11.65 10.79,12.32 10.41,13.08 10.41,13.59 11.68,14.86 11.68,15.24 11.81,15.37
AIN_7  (via drill 0.5)
  Route2 0.254: v22.23,49.91 16.89,49.91 J11.8
  Bottom 0.254: C24.1 23.15,24.69 | C24.1 24.69,26.38 arc45 24.77,26.56 v24.77,27.3 24.77,27.56 25.78,28.58 26.54,28.58 27.3,29.34 27.3,40 28.58,41.28 28.58,43.56 28.19,43.94 23.88,43.94 23.5,44.32 23.5,48.64 v22.23,49.91 | C24.1 22.99,24.68 22.99,23.75 22.31,23.08 R55.2 21.63,22.99 20.96,22.99 19.26,21.29 IC4.14
AOUT_0  (via drill 0.5)
  Route2 0.254: v27.56,43.05 27.3,43.31 12.83,43.31 10.29,40.77 10.29,31.75 9.78,30.99 9.78,30.61 10.29,29.85 10.29,28.83 9.52,28.32 U$1.OUT_PIN1
  Bottom 0.254: R60.1 27.22,43.31 v27.56,43.05
AOUT_1
  Bottom 0.254: 26.04,30.61 R57.1 25.95,30.86 22.84,30.86 arc45 22.66,30.79 21.38,29.5 arc-45 20.97,29.34 19.89,29.34 arc-45 19.54,29.49 18.74,30.28 arc45 18.56,30.35 14.6,30.35 9.52,25.27 U$1.OUT_PIN2
AOUT_2  (via drill 0.5)
  Route2 0.254: U$1.OUT_PIN3 9.02,22.23 8.25,22.99 8.25,28.83 v9.4,29.72
  Bottom 0.254: v9.4,29.72 8.76,30.52 R59.1
AOUT_3  (via drill 0.5)
  Route2 0.254: v9.52,43.05 8,41.53 8,30.1 7.75,29.85 7.75,20.96 9.02,19.69 U$1.OUT_PIN4
  Bottom 0.254: R63.1 9.44,43.05 v9.52,43.05
AOUT_4  (via drill 0.5)
  Top 0.254: v8,43.56 8.25,43.56 R65.1
  Route2 0.254: U$1.OUT_PIN5 7.75,17.14 7.07,18.22 7.07,30.43 7.24,30.61 7.24,42.97 v8,43.56
AOUT_5  (via drill 0.5)
  Top 0.254: R67.1 9.87,30.77 v10.67,30.73
  Route2 0.254: v10.67,30.73 10.79,30.1 10.79,15.88 U$1.OUT_PIN6
AOUT_6
  Top 0.254: R69.1 24.17,30.52 23.62,29.97 23.62,29.21 21.97,27.56 13.33,27.56 11.05,25.27 11.05,16.64 10.29,15.88 8.76,15.88 8.25,15.37 8.25,13.34 U$1.OUT_PIN7
AOUT_7  (via drill 0.5)
  Top 0.254: R71.1 23.92,42.12 v23.75,42.29
  Route2 0.254: v23.75,42.29 12.83,42.29 10.79,40.26 10.79,32 11.56,31.12 11.56,30.1 11.3,29.85 11.3,14.48 10.16,13.34 8.76,13.34 8.25,12.83 8.25,10.8 U$1.OUT_PIN8
N$1
  Top 0.254: IC1.5 26.69,12.15 R5.2 27.73,12.15 28.32,11.56 28.32,10.96 C2.1
N$2  (via drill 0.5)
  Top 0.254: IC1.2 24.73,13.4 arc-90 24.42,13.08 22.48,13.08 21.63,12.23 R1.1 20.03,12.23 v18.67,13.59
  Route2 0.254: v18.67,13.59 15.87,16.38 15.87,17.91 20.07,22.1 24.89,22.1 28.83,26.04 v28.83,27.05
  Bottom 0.254: J12A.1 28.83,35.43 v28.83,27.05
N$3  (via drill 0.5)
  Top 0.254: IC1.1 24.09,13.93 23.24,13.93 | 23.24,13.93 R1.2 | R4.1 25.87,7.41 v25.02,8.26 | v22.99,15.11 22.99,14.19 23.24,13.93
  Route2 0.254: v25.02,8.26 25.02,13.08 v22.99,15.11
N$4
  Top 0.254: R5.1 R4.2 26.8,9.53 29.34,9.53 30.35,8.51 31.75,8.51 arc90 32.38,9.14 32.38,11.72 C3.2
N$5
  Bottom 0.254: IC5.2 IC5.1 19.77,40.11 arc-90 20.08,40.42 C25.2 22.64,40.42 C27.1
N$6
  Top 0.254: R7.2 31.71,15.11 30.86,15.11 29.85,14.1 R6.1 29.59,14.61 29.21,14.99 27.69,14.99 27.34,14.64 IC1.6
N$7
  Top 0.254: IC1.3 25.39,11.81 R3.2 C1.1
N$8
  Top 0.254: R2.2 J12A.2
N$9  (via drill 0.5)
  Top 0.254: R8.2 28.07,19.85 IC1.8 27.98,18.59 v27.81,18.42 | 26.04,25.69 R11.1 v27.43,25.78
  Bottom 0.254: v27.81,18.42 27.81,25.4 v27.43,25.78
N$10
  Top 0.254: C6.2 23.75,25.78 | 23.75,25.78 R11.2 | R12.1 23.75,23.84 23.75,25.78
N$11
  Top 0.254: IC1.12 25.39,21.97 C5.1 25.36,21.8 25.78,22.23 25.78,23.84 R12.2
N$12
  Bottom 0.254: R60.2 24.77,40.42 | 24.77,40.42 R61.1 | C27.2 24.77,40.51 24.77,40.42
N$13
  Top 0.254: IC1.13 24.73,20.38 arc90 24.42,20.7 22.73,20.7 21.63,21.8 R13.1 20.87,21.8 20.19,22.48 20.19,23.41 R14.2
N$14
  Top 0.254: IC2.1 36.03,17.06 R15.2 | 35.52,16.98 R15.2 | R18.1 33.78,12.87 33.78,14.99 34.42,15.62 34.42,16.64 34.92,17.14 35.6,17.14 R15.2
N$15
  Top 0.254: IC1.10 26.69,21.88 R10.2 27.38,21.88 C4.1
N$16  (via drill 0.5)
  Top 0.254: IC1.9 27.34,20.45 arc-90 27.59,20.7 28.58,20.7 29.43,21.55 R8.1 29.93,21.46 v30.86,21.46
  Bottom 0.254: v30.86,21.46 31.88,22.23 31.88,35.43 J12B.1
N$17  (via drill 0.5)
  Top 0.254: 23.5,10.03 C1.2 23.41,9.69 v22.23,8.51
  Route2 0.254: v22.23,8.51 21.21,8.76 13.08,8.76 12.57,9.27 11.81,9.27 10.79,8.26 8.51,8.26 6.73,10.03 6.73,17.65 6.48,17.91 6.48,30.86 6.73,31.12 6.73,56.2 7.81,57.28 26.54,57.28 27.56,58.29 27.56,60.83 28.58,61.85 31.62,61.85 32.38,61.34 J1.2
N$18  (via drill 0.5)
  Top 0.254: 30.35,23.24 C4.2 30.44,23.92 v30.86,24.51
  Route2 0.254: J1.3 31.12,58.04 31.12,43.56 30.35,42.8 v30.35,40.26
  Bottom 0.254: v30.35,40.26 30.35,34.42 31.12,33.66 31.12,24.77 v30.86,24.51
N$19  (via drill 0.5)
  Top 0.254: IC2.2 38.96,16.38 arc-90 38.7,16.13 36.45,16.13 35.85,15.53 R15.1 34.76,14.61 v34.67,14.61
  Bottom 0.254: J12C.1 34.16,35.18 32.38,33.4 32.38,21.21 34.8,18.8 34.8,15.37 34.67,14.73 v34.67,14.61
N$20
  Top 0.254: R19.1 43.81,11.98 C9.2 45.34,7.87 arc-90 44.7,7.24 41.11,7.24 R18.2
N$21
  Top 0.254: IC2.5 40.91,12.6 R19.2 42.04,11.72 C8.1
N$22
  Bottom 0.254: IC5.3 22.99,37.1 C26.1 R61.2
N$23
  Top 0.254: R20.1 41.56,13.84 IC2.6 41.56,17.81 41.78,18.03 42.67,18.03 43.05,17.65 43.05,16.89 44.07,15.88 44.58,15.88 45.17,15.28 R21.2
N$24
  Top 0.254: R16.2 J12C.2
N$25
  Top 0.254: IC2.3 39.61,14.35 R17.2 C7.1
N$26
  Top 0.254: IC2.8 45.34,22.81 R22.2 45.34,22.73 45.72,22.73 arc90 46.35,23.37 46.35,29.08 44.32,31.12 R25.1
N$28  (via drill 0.5)
  Top 0.254: R26.1 37.63,25.78 C12.2 v38.48,25.78 | R25.2 41.78,31.03 41.78,30.61 | 41.78,30.61 v41.78,29.59 | v40.51,31.12 41.27,31.12 41.78,30.61
  Bottom 0.254: v38.48,25.78 38.48,26.04 36.7,27.81 36.7,30.86 37.59,31.75 39.62,31.75 v40.51,31.12
N$29
  Top 0.254: C11.1 R26.2 39.61,27.56 IC2.12
N$30
  Bottom 0.254: C29.2 24.77,32.39 24.77,32.47 | 24.77,32.47 R58.1 | R57.2 24.77,32.47
N$31
  Top 0.254: IC2.13 38.96,21.97 arc-90 38.7,21.72 37.21,21.72 36.7,22.23 35.85,22.23 R27.1 35.6,22.48 34.67,22.48 33.15,24 33.15,26.54 34.33,27.73 R28.2
N$32  (via drill 0.5)
  Top 0.254: R22.1 44.92,24.35 44.32,23.75 41.81,23.75 arc90 41.56,23.5 IC2.9 41.56,20.7 v41.53,20.7
  Route2 0.254: v41.53,20.7 41.53,25.02 35.05,31.5 35.05,32.64 36.7,34.29 J12D.1
N$33
  Top 0.254: R23.2 J12D.2
N$34
  Top 0.254: C10.1 R24.2 40.91,25.5 IC2.10
N$35  (via drill 0.5)
  Top 0.254: C7.2 37.63,11.02 arc45 37.72,10.79 v39.5,9.02
  Route2 0.254: J2.2 42.54,58.04 45.59,54.99 46.73,54.99 48.39,53.34 48.39,50.04 arc45 48.48,49.82 49.31,48.99 arc45 49.53,48.89 50.87,48.89 arc-90 51.43,48.33 51.43,16.38 50.93,15.88 49.4,15.88 48.89,15.37 48.89,11.43 46.86,9.4 46.86,8.76 45.59,7.49 41.02,7.49 v39.5,9.02
N$36  (via drill 0.5)
  Top 0.254: C10.2 v44.83,27.81
  Route2 0.254: J2.3 40,59.56 43.81,55.75 43.81,45.34 45.59,43.56 45.59,33.17 arc45 45.96,32.27 46.12,32.11 arc-45 46.35,31.54 46.35,29.86 arc-45 45.98,28.96 v44.83,27.81
  Route15 0.254: v44.83,27.81 44.83,28.07
N$37
  Bottom 0.254: IC3.1 46.52,16.81 R29.2 47.54,16.73 48.39,15.88 48.39,8.93 46.7,7.24 R32.1
N$38
  Bottom 0.254: R32.2 41.7,5.97 39.9,5.97 38.57,7.29 arc-45 38.48,7.52 38.48,10.29 38.64,10.45 arc-45 38.87,10.54 R33.1 | C15.2 38.65,10.54 R33.1 | 38.97,10.36 arc45 R33.1
N$39
  Bottom 0.254: IC3.5 41.64,11.58 R33.2 40.51,10.54 40.67,10.38 arc-45 40.77,10.16 40.93,9.99 arc-45 41.02,9.77 C14.1
N$40
  Bottom 0.254: IC5.5 22.99,35.8 C28.1 R58.2
N$41
  Bottom 0.254: R34.1 40.99,13.73 IC3.6 40.99,18.57 40,19.56 38.99,19.56 38.61,19.18 38.61,15.11 38.27,14.77 R35.2
N$42
  Bottom 0.254: IC3.3 42.94,13.36 R31.2 C13.1
N$43  (via drill 0.5)
  Route2 0.254: J12E.1 43.05,31.88 43.05,27.81 48.64,22.23 48.64,18.67 48.89,18.42 48.89,17.14 48.26,16.51 48.26,11.81 48.01,11.56 v47.37,11.56
  Bottom 0.254: IC3.2 43.59,15.88 45.76,15.88 R29.1 46.7,15.03 47.62,14.1 47.62,11.81 v47.37,11.56
N$44
  Top 0.254: R30.2 J12E.2
N$45
  Bottom 0.254: IC3.8 37.55,22.56 R36.2 37.38,22.73 R39.1
N$46  (via drill 0.5)
  Top 0.254: v45.34,31.37 44.32,32.39 36.7,32.39 v36.07,32.26
  Bottom 0.254: R40.1 45.43,28.92 C18.2 46.86,29.85 v45.34,31.37 | v36.07,32.26 35.43,31.62 35.43,25.02 34.16,23.75 34.16,22.82 R39.2
N$47
  Bottom 0.254: C17.1 43.73,31.03 R40.2 42.94,28.8 IC3.12
N$48
  Bottom 0.254: IC5.6 IC5.7 19.77,33.05 arc90 20.08,32.73 C30.2 21.3,32.64 C29.1 22.64,32.47
N$49
  Bottom 0.254: 43.98,26.12 R41.1 44.07,26.2 44.07,25.78 44.83,25.02 44.83,24.26 44.32,23.75 43.81,23.75 43.56,23.5 43.56,22.59 IC3.13 43.59,21.81 43.81,21.59 44.7,21.59 46.01,22.9 R42.2
N$50
  Bottom 0.254: IC3.10 41.64,26.04 R38.2 C16.1
N$51
  Bottom 0.254: IC3.9 40.99,23.18 arc90 40.67,23.5 38.31,23.5 R36.1 35.94,25.87 35.94,30.86 37.46,32.39 39.5,32.39 41.78,34.92 J12F.1
N$52
  Top 0.254: R37.2 J12F.2
N$53  (via drill 0.5)
  Top 0.254: v35.43,43.41 37.06,43.41 37.46,43.81 37.46,44.83 34.67,47.62 34.67,48.39 32.38,50.67 J3.2
  Route2 0.254: v46.35,10.54 46.35,11.81 47.62,13.08 47.62,14.1 45.09,16.64 43.31,16.64 40,19.94 40,21.97 35.69,26.29 35.69,30.1 34.42,31.37 34.42,32.89 35.43,33.91 v35.43,43.41
  Bottom 0.254: C13.2 45.68,10.54 v46.35,10.54
N$54  (via drill 0.5)
  Top 0.254: J3.3 29.85,50.67 31.37,49.15 32.89,49.15 33.91,48.13 33.91,46.86 v36.45,44.32
  Route2 0.254: v36.45,44.32 36.45,43.56 37.97,42.04 37.97,32.39 v39.37,30.86
  Bottom 0.254: C16.2 39.92,30.19 v39.37,30.86
N$55
  Bottom 0.254: 20.36,15.54 R43.2 | IC4.1 20.45,15.54 R43.2 | R43.2 R46.1
N$56  (via drill 0.5)
  Route2 0.254: v12.06,8.26 20.96,8.26 21.72,7.49 22.86,7.49 v23.24,7.87
  Bottom 0.254: R46.2 22.23,10.03 23.24,9.02 v23.24,7.87 | v12.06,8.26 12.06,9.69 | 12.06,9.69 C21.2 | 12.06,9.69 12.48,9.69 13.08,10.29 R47.1
N$57
  Bottom 0.254: IC4.5 16.24,13.99 16.64,13.59 16.64,11.47 R47.2 15.62,10.45 C20.1
N$58
  Bottom 0.254: R59.2 9.27,32.73 | 9.27,32.73 R62.1 | C32.2 9.27,32.13 9.27,32.73
N$59
  Bottom 0.254: IC4.6 15.59,14.74 R48.1 R49.2
N$60
  Bottom 0.254: C19.1 17.82,10.72 R45.2 17.54,11.84 IC4.3
N$61  (via drill 0.5)
  Top 0.254: J12G.1 44.32,35.43 43.05,34.16 34.92,34.16 34.16,33.4 34.16,32.13 33.65,31.62 32.89,31.62 30.35,29.08 v29.85,29.08
  Route2 0.254: v18.16,18.92 18.16,19.18 20.45,21.59 25.15,21.59 29.85,26.29 v29.85,29.08
  Bottom 0.254: 20.54,13.76 R43.1 20.28,13.76 19.43,14.61 18.51,14.61 arc-90 18.19,14.92 IC4.2 18.19,18.89 v18.16,18.92
N$62
  Top 0.254: R44.2 J12G.2
N$63
  Bottom 0.254: IC4.8 13.6,21.29 R50.2 R53.1
N$64  (via drill 0.5)
  Route2 0.254: v13.59,26.54 v19.18,26.54
  Bottom 0.254: C24.2 R54.1 19.18,24.85 v19.18,26.54 | R53.2 12.41,25.36 v13.59,26.54
N$65
  Bottom 0.254: IC4.12 17.54,24.74 R54.2 17.57,26.11 C23.1
N$66
  Bottom 0.254: IC5.10 11.05,35.8 C31.1 R62.2
N$67
  Bottom 0.254: R56.2 22.99,21.38 R55.1 20.79,20.45 18.42,20.45 18.19,20.67 IC4.13
N$68
  Bottom 0.254: IC4.10 16.24,24.49 R52.2 15.96,26.04 C22.1
N$69  (via drill 0.5)
  Top 0.254: J12H.1 45.09,33.66 35.18,33.66 34.67,33.15 34.67,31.88 33.78,30.99 33.02,30.99 30.1,28.07 26.54,28.07 v26.04,27.56
  Route2 0.254: v15.11,22.73 16.64,22.73 22.23,28.32 25.27,28.32 v26.04,27.56
  Bottom 0.254: R50.1 12.95,20.83 13.59,20.32 15.23,20.32 arc45 15.46,20.41 15.59,20.67 IC4.9 15.59,22.26 v15.11,22.73
N$70
  Top 0.254: R51.2 J12H.2
N$71  (via drill 0.5)
  Route2 0.254: J4.2 42.54,50.42 39.75,46.1 36.2,46.1 32.89,42.8 32.89,34.92 31.62,33.66 31.62,27.05 32.26,26.16 32.26,21.08 31.62,20.45 v31.62,19.94 | v19.56,9.65 20.83,9.65 22.23,9.53 23.24,9.53 24,8.76 24,8.26 24.64,7.37 25.4,7.37 30.1,11.81 v33.4,11.81
  Bottom 0.254: C19.2 18.71,8.89 v19.56,9.65 | v31.62,19.94 32.89,19.94 34.29,18.54 34.29,15.75 33.4,14.86 v33.4,11.81
N$72  (via drill 0.5)
  Top 0.254: v15.11,29.21 14.86,29.08 11.56,29.08 10.92,28.45 7.87,28.45 6.22,30.1 6.22,52.45 8.76,54.99 37.72,54.99 J4.3
  Bottom 0.254: 15.96,27.73 C22.2 15.87,28.32 v15.11,29.21
N$73
  Bottom 0.254: IC5.9 IC5.8 14.02,33.05 arc-90 13.7,32.73 C33.2 12.83,32.64 C32.1
N$74
  Bottom 0.254: R63.2 9.27,40.17 | C35.2 9.69,40.17 9.27,40.17 | 9.27,40.17 R64.1
N$75
  Bottom 0.254: IC5.12 11.05,37.1 C34.1 R64.2
N$76
  Bottom 0.254: IC5.13 IC5.14 14.02,40.11 arc90 13.7,40.42 C36.2 12.83,40.51 C35.1
N$77
  Top 0.254: R65.2 9.02,40.42 | 9.02,40.42 R66.1 | C38.2 9.69,40.42 9.02,40.42
N$78
  Top 0.254: IC6.3 10.79,37.1 C37.1 R66.2
N$79
  Top 0.254: R9.2 J12B.2
N$80
  Top 0.254: IC6.2 IC6.1 14.02,40.11 arc90 13.7,40.42 C39.2 12.83,40.77 C38.1
N$81
  Top 0.254: R68.1 9.02,32.47 | 9.02,32.47 R67.2 | C41.2 9.69,32.47 9.02,32.47
N$82
  Top 0.254: IC6.5 10.79,35.8 C40.1 9.02,35.52 R68.2
N$83
  Top 0.254: IC6.6 IC6.7 14.02,32.79 arc-90 13.7,32.47 C42.2 11.39,32.47 C41.1
N$84
  Top 0.254: R69.2 24.77,32.22 | 24.77,32.22 24.35,32.22 C44.2 | R70.1 24.77,32.22
N$85
  Top 0.254: R70.2 22.99,35.01 C43.1 22.99,35.8 IC6.10
N$86
  Top 0.254: IC6.9 IC6.8 19.77,33.05 arc90 20.08,32.73 C45.2 21.46,32.64 21.88,32.64 C44.1
N$87
  Top 0.254: C47.2 24.77,40.51 24.77,40.42 | 24.77,40.42 R72.1 | R71.2 24.77,40.42
N$88
  Top 0.254: IC6.12 22.99,37.1 C46.1 22.99,37.63 R72.2
N$89
  Top 0.254: IC6.13 IC6.14 19.77,40.11 arc-90 20.08,40.42 C48.2 21.04,40.51 C47.1
N$90  (via drill 0.5)
  Top 0.254: J8.2 23.5,50.42 23.5,43.81 24,43.31 26.04,43.31 26.67,42.8 26.67,41.15 27.05,40.77 27.05,29.85 26.54,29.34 v24.44,29.34 | v22.73,29.59 21.55,31.03 C45.1
  Route2 0.254: v22.73,29.59 23.24,29.34 v24.44,29.34
N$91
  Top 0.254: J7.2 10.79,50.42 10.79,43.81 12.48,42.12 C39.1
O0
  Bottom 0.254: C25.1 21.21,42.8 20.96,43.05 20.96,61.34 20.19,62.1 13.33,62.1 12.06,60.83 J5.2
O2  (via drill 0.5)
  Top 0.254: J6.2 19.43,56.26 18.67,55.5 v7.75,55.5
  Bottom 0.254: C33.1 12.74,31.03 10.16,28.45 8.13,28.45 7.75,28.83 7.75,29.59 7.24,30.1 7.24,42.29 6.99,42.55 6.99,44.32 8.76,46.1 8.76,50.17 7.75,51.18 v7.75,55.5
O3
  Bottom 0.254: C36.1 13.33,42.63 13.33,46.36 13.08,46.61 13.08,48.39 15.11,50.42 16.13,50.42 16.64,50.93 16.64,56.77 J6.3
O5
  Top 0.254: J7.3 6.73,49.66 6.73,30.35 8.13,28.93 10.54,28.93 12.19,30.61 12.66,30.61 C42.1 12.74,30.77
O7
  Top 0.254: J8.3 20.96,50.42 C48.1
PE  (via drill 0.5)
  Top 0.254: C5.2 23.33,21.97 23.33,22.64 22.48,23.5 R14.1 | R10.1 27.14,23.58 | 35.77,29.34 R28.1 | R21.1 45.5,16.98 | R24.1 43.56,25.87 | C11.2 37.54,29.43 | 23.24,11.81 R3.1 | 35.52,18.92 C52.2 | 35.43,29.68 35.52,29.68 35.69,29.51 R28.1 | 35.6,29.34 R28.1 | C8.2 42.12,8.51 | 37.46,14.61 R17.1 | 20.54,7.08 arc-45 20.57,6.99 | 37.72,29.59 37.46,29.59 37.72,29.34 | R37.1 41.44,42.12 41.27,42.29 41.62,42.29 R37.1
  Top 0.406: C2.2 31.46,9.53 v31.37,9.53 | C51.2 22.64,16.04 v23.75,17.14 | 27.14,23.58 28.32,24.77 v29.59,24.77 33.91,29.34 35.6,29.34 | R2.1 R9.1 R16.1 R23.1 R30.1 R37.1 R44.1 R51.1 v46.86,44.07 | C40.2 11.98,33.82 v12.57,34.42 | C43.2 22.31,33.57 v21.46,34.42 | C46.2 22.06,39.08 v21.46,38.48 | 37.63,14.26 R17.1 36.45,14.35 v35.69,13.59 | 37.54,29.43 R28.1 | 43.56,25.87 43.56,25.02 v43.81,24.77 | 23.24,11.81 22.23,10.8 22.23,10.03 21.21,9.02 21.21,7.75 20.54,7.08 | R7.1 32.98,16.98 33.78,17.78 | 33.78,17.78 34.92,18.92 35.52,18.92 | C5.2 24.51,22.82 v24.51,22.99 | v16.64,29.34 16.04,29.93 C56.2 17.91,34.5 17.91,37.47 v16.89,38.48 | IC7.5 15.68,10.77 C50.1 16.13,9.78 18.92,6.99 20.57,6.99 v20.7,6.99 | 42.12,8.51 v43.81,8.51 43.81,8.26 | v32.89,18.67 33.78,17.78 | C37.2 11.9,39.24 v12.57,38.48 | 46.95,16.98 R21.1 | v47.88,17.91 46.95,16.98 | v37.72,30.61 37.72,29.59 | v46.61,13.34 46.86,13.34 47.12,13.59 47.12,16.81 46.95,16.98 | v11.3,6.99 11.05,7.24 11.05,12.83 v11.43,13.21
  Route2 0.254: 40.13,13.59 arc-45 40.35,13.5
  Route2 0.406: v21.46,34.42 v21.46,38.48 v16.89,38.48 v12.57,38.48 v12.57,34.42 | 43.56,10.29 v46.61,13.34 | v37.72,30.61 43.56,24.77 v43.81,24.77 44.58,24.77 v47.62,21.72 47.62,18.16 v47.88,17.91 | v46.86,44.07 46.86,41.53 48.64,39.75 48.64,31.12 v48.51,30.99 | v43.81,8.51 43.56,8.76 43.56,10.29 | v35.69,13.59 40.13,13.59 | 40.35,13.5 43.56,10.29 | v16.64,29.34 16.64,28.32 15.87,27.56 13.08,27.56 12.7,27.18 12.7,24.13 v13.84,22.99 13.84,22.73 14.86,21.72 18.42,21.72 19.69,22.99 v24.51,22.99 | TP1.TP 44.07,4.45 42.54,5.97 39.75,5.97 36.2,9.53 v31.37,9.53
  Bottom 0.254: v31.37,9.53 31.62,9.78 | C46.2 22.39,38.48 v21.46,38.48 | C55.2 17.74,39.33 v16.89,38.48 16.89,38.57 | C43.2 22.14,34.42 v21.46,34.42 | 11.39,38.73 C34.2 11.64,38.48 v12.57,38.48 | C31.2 11.98,33.82 v12.57,34.42 | 15.28,7.15 C20.2 15.79,6.99 | R45.1 19.69,11.65 19.69,11.44 arc45 19.78,11.21 | C23.2 17.57,28.07 | C54.2 21.72,17.14 | 24.85,17.14 v23.75,17.14 | v29.59,24.77 29.34,24.51 | 20.61,10.38 arc-45 20.7,10.16 | R49.1 13.33,12.32 12.57,12.83 11.56,12.83 v11.43,13.21
  Bottom 0.406: 31.62,9.78 31.62,10.8 | 31.62,10.8 31.62,17.14 | 29.34,17.14 v23.75,17.14 21.72,17.14 | 29.34,17.14 31.62,17.14 | v46.61,13.34 R31.1 | C17.2 45.5,32.73 47.24,30.99 v48.51,30.99 48.64,30.61 48.64,24.77 | 48.64,24.77 48.64,22.48 v47.62,21.72 | R38.1 39.5,26.04 37.72,27.81 v37.72,30.61 | R35.1 C53.2 36.87,19.09 35.69,17.91 v35.69,13.59 35.69,12.83 33.91,10.8 31.62,10.8 | 15.28,7.15 14.86,6.73 11.56,6.73 v11.3,6.99 | 15.79,6.99 v20.7,6.99 | v24.51,22.99 24.85,22.64 R56.1 24.85,17.14 | R52.1 13.84,24.09 v13.84,22.99 | v20.7,6.99 28.83,6.99 v31.37,9.53 | 29.34,24.51 29.34,17.14 | 31.62,17.14 32.89,18.42 v32.89,18.67 | 19.78,11.21 20.61,10.38 | 20.7,10.16 v20.7,6.99 | C14.2 42.12,8.51 v43.81,8.51 | v16.64,29.34 17.4,29.34 17.65,29.08 C23.2 | R42.1 48.47,24.6 48.64,24.77
V+  (via drill 0.5)
  Top 0.254: IC1.4 26.04,14.61 v27.3,15.88 29.68,15.88 C57.2 | IC6.4 15.02,36.45 15.11,36.54 | 15.79,40.77 C62.2 16.04,40.68 15.11,39.75 15.11,36.54 | IC2.4 40.26,17.65 41.53,18.92 v43.05,18.92 45.17,18.92 C58.2 47.97,19.09 48.89,18.16 48.89,13.34 U$1.54 | IC7.3 11.81,14.19 11.81,16 v12.19,16.38 | 15.11,36.54 15.2,36.45 v16.89,36.45 | C49.1 14.54,14.96 IC7.1
  Top 0.406: C49.1 14.69,16.22 15.11,16.64 15.11,19.18 14.6,19.69 13.08,19.69 12.06,18.67 12.06,16.51 v12.19,16.38 | U$1.54 U$1.53
  Route2 0.254: 17.06,17.4 v16.89,17.57 | 27.56,15.62 v27.3,15.88
  Route2 0.406: 17.06,17.4 21.97,17.4 23.5,15.88 v27.3,15.88 30.61,15.88 31.12,15.37 31.62,15.37 40.26,6.73 47.37,6.73 48.13,7.49 48.13,9.53 49.91,11.3 49.91,11.81 U$1.54 | v12.19,16.38 12.06,16.51 12.06,29.59 12.19,29.72 12.19,31.12 14.02,33.07 14.02,35.67 14.79,36.45 v16.89,36.45
  Bottom 0.254: IC5.4 17.74,36.45 | 17.74,36.45 C61.2 | C59.2 45.68,17.91 42.8,17.91 | 42.8,17.91 42.61,17.91 arc90 42.29,17.59 IC3.4 | IC4.4 v16.89,17.57 16.64,17.82 C60.2 12.32,17.31 v12.19,16.38 | v43.05,18.92 42.8,18.67 42.8,17.91 | v16.89,36.45 17.74,36.45
V-  (via drill 0.38, 0.5)
  Top 0.254: v26.04,18.42 22.14,18.42 C51.1 21.38,17.74 v20.19,18.92 | v26.04,18.42 IC1.11 | v26.04,18.42 27.05,17.4 29.25,17.4 C57.1 | IC6.11 19.07,36.45 arc90 18.76,36.13 18.76,33.66 C56.1 18.5,31.62 v19.18,31.62 | IC2.11 40.26,19.69 | 40.26,19.69 38.73,19.69 | 38.73,19.69 36.87,19.69 C52.1 | v14.6,41.28 15.37,42.04 15.87,42.04 | 15.87,42.04 17.14,42.04 17.74,41.44 C62.1 | J7.1 15.87,50.42 15.87,42.04 | IC7.2 13.59,14.52 C49.2 12.99,17.82 v13.84,18.67 | IC7.2 13.59,12.83 | U$1.OUT_PIN10 10.29,4.45 13.59,7.75 13.59,12.07 | 13.59,12.07 IC7.2 | 40.26,19.69 42.29,19.69 43.39,20.54 v43.99,20.54 C58.1 45.09,20.96 | 38.73,19.69 v38.73,20.96 | C50.2 15.96,12.92 15.11,12.07 13.59,12.07
  Route15 0.254: U$1.OUT_PIN10 U$1.1 U$1.2 | v19.18,31.62 19.85,31.62 arc-45 20.87,31.2 arc-45 21.46,29.77 21.46,27.3 26.04,22.73 v26.04,18.42
  Bottom 0.254: IC5.11 15.02,36.45 | C61.1 15.79,32.39 | IC3.11 42.29,21.59 | IC4.11 16.89,20.19 | C60.1 12.32,19.69 13.84,19.69 | 13.84,19.69 16.38,19.69 16.89,20.19 | C54.1 21.63,18.92 v20.19,18.92 19.18,19.94 17.14,19.94 16.89,20.19 | C61.1 16.8,31.37 18.92,31.37 v19.18,31.62 | v14.6,41.28 C55.1 16.04,41.19 15.11,40.26 15.11,36.54 15.02,36.45 | v13.84,18.67 13.84,19.69 | 15.02,36.45 15.11,36.36 15.11,33.4 16.04,32.47 C61.1 | C53.1 37.46,20.96 v38.73,20.96 39.37,21.59 42.29,21.59 | U$1.IN_PIN10 9.52,46.1 12.57,49.66 13.33,49.66 14.6,50.93 J7.1 | 42.29,21.59 43.35,20.54 v43.99,20.54 C59.1
  pour Route15: 0.64,62.36 53.66,62.36 arc-90 53.97,60.77 53.97,1.4 44.45,1.4 arc-45 44.23,1.49 39.75,5.97 15.5,5.97 arc45 15.27,5.88 11.05,1.65 0.95,1.65 arc-90 0.64,1.97
VDD_3V3EXP
  Top 0.254: U$1.49 U$1.50
VDD_5V  (1 unrouted)

### Text on the board
tPlace: 0-1 | 2-3 | 0-1 | 2-3 | OUT | OUT | IN | IN | 4-5 | 6-7 | 4-5 | 6-7 | To Analog / Inputs | J10 | (c) 2016 / LsPardue / AMcPherson / C4DM, QMUL | IN-Gain | 0 | 1 | 2 | 3 | 4 | 5 | 6 | 7 | x10 | Audio Expander | Capelet | 07/16 / rev. A2 | Vref | J9